# EAGLE design daq_4ch_24bit_eagle (EAGLE 9.4.2)
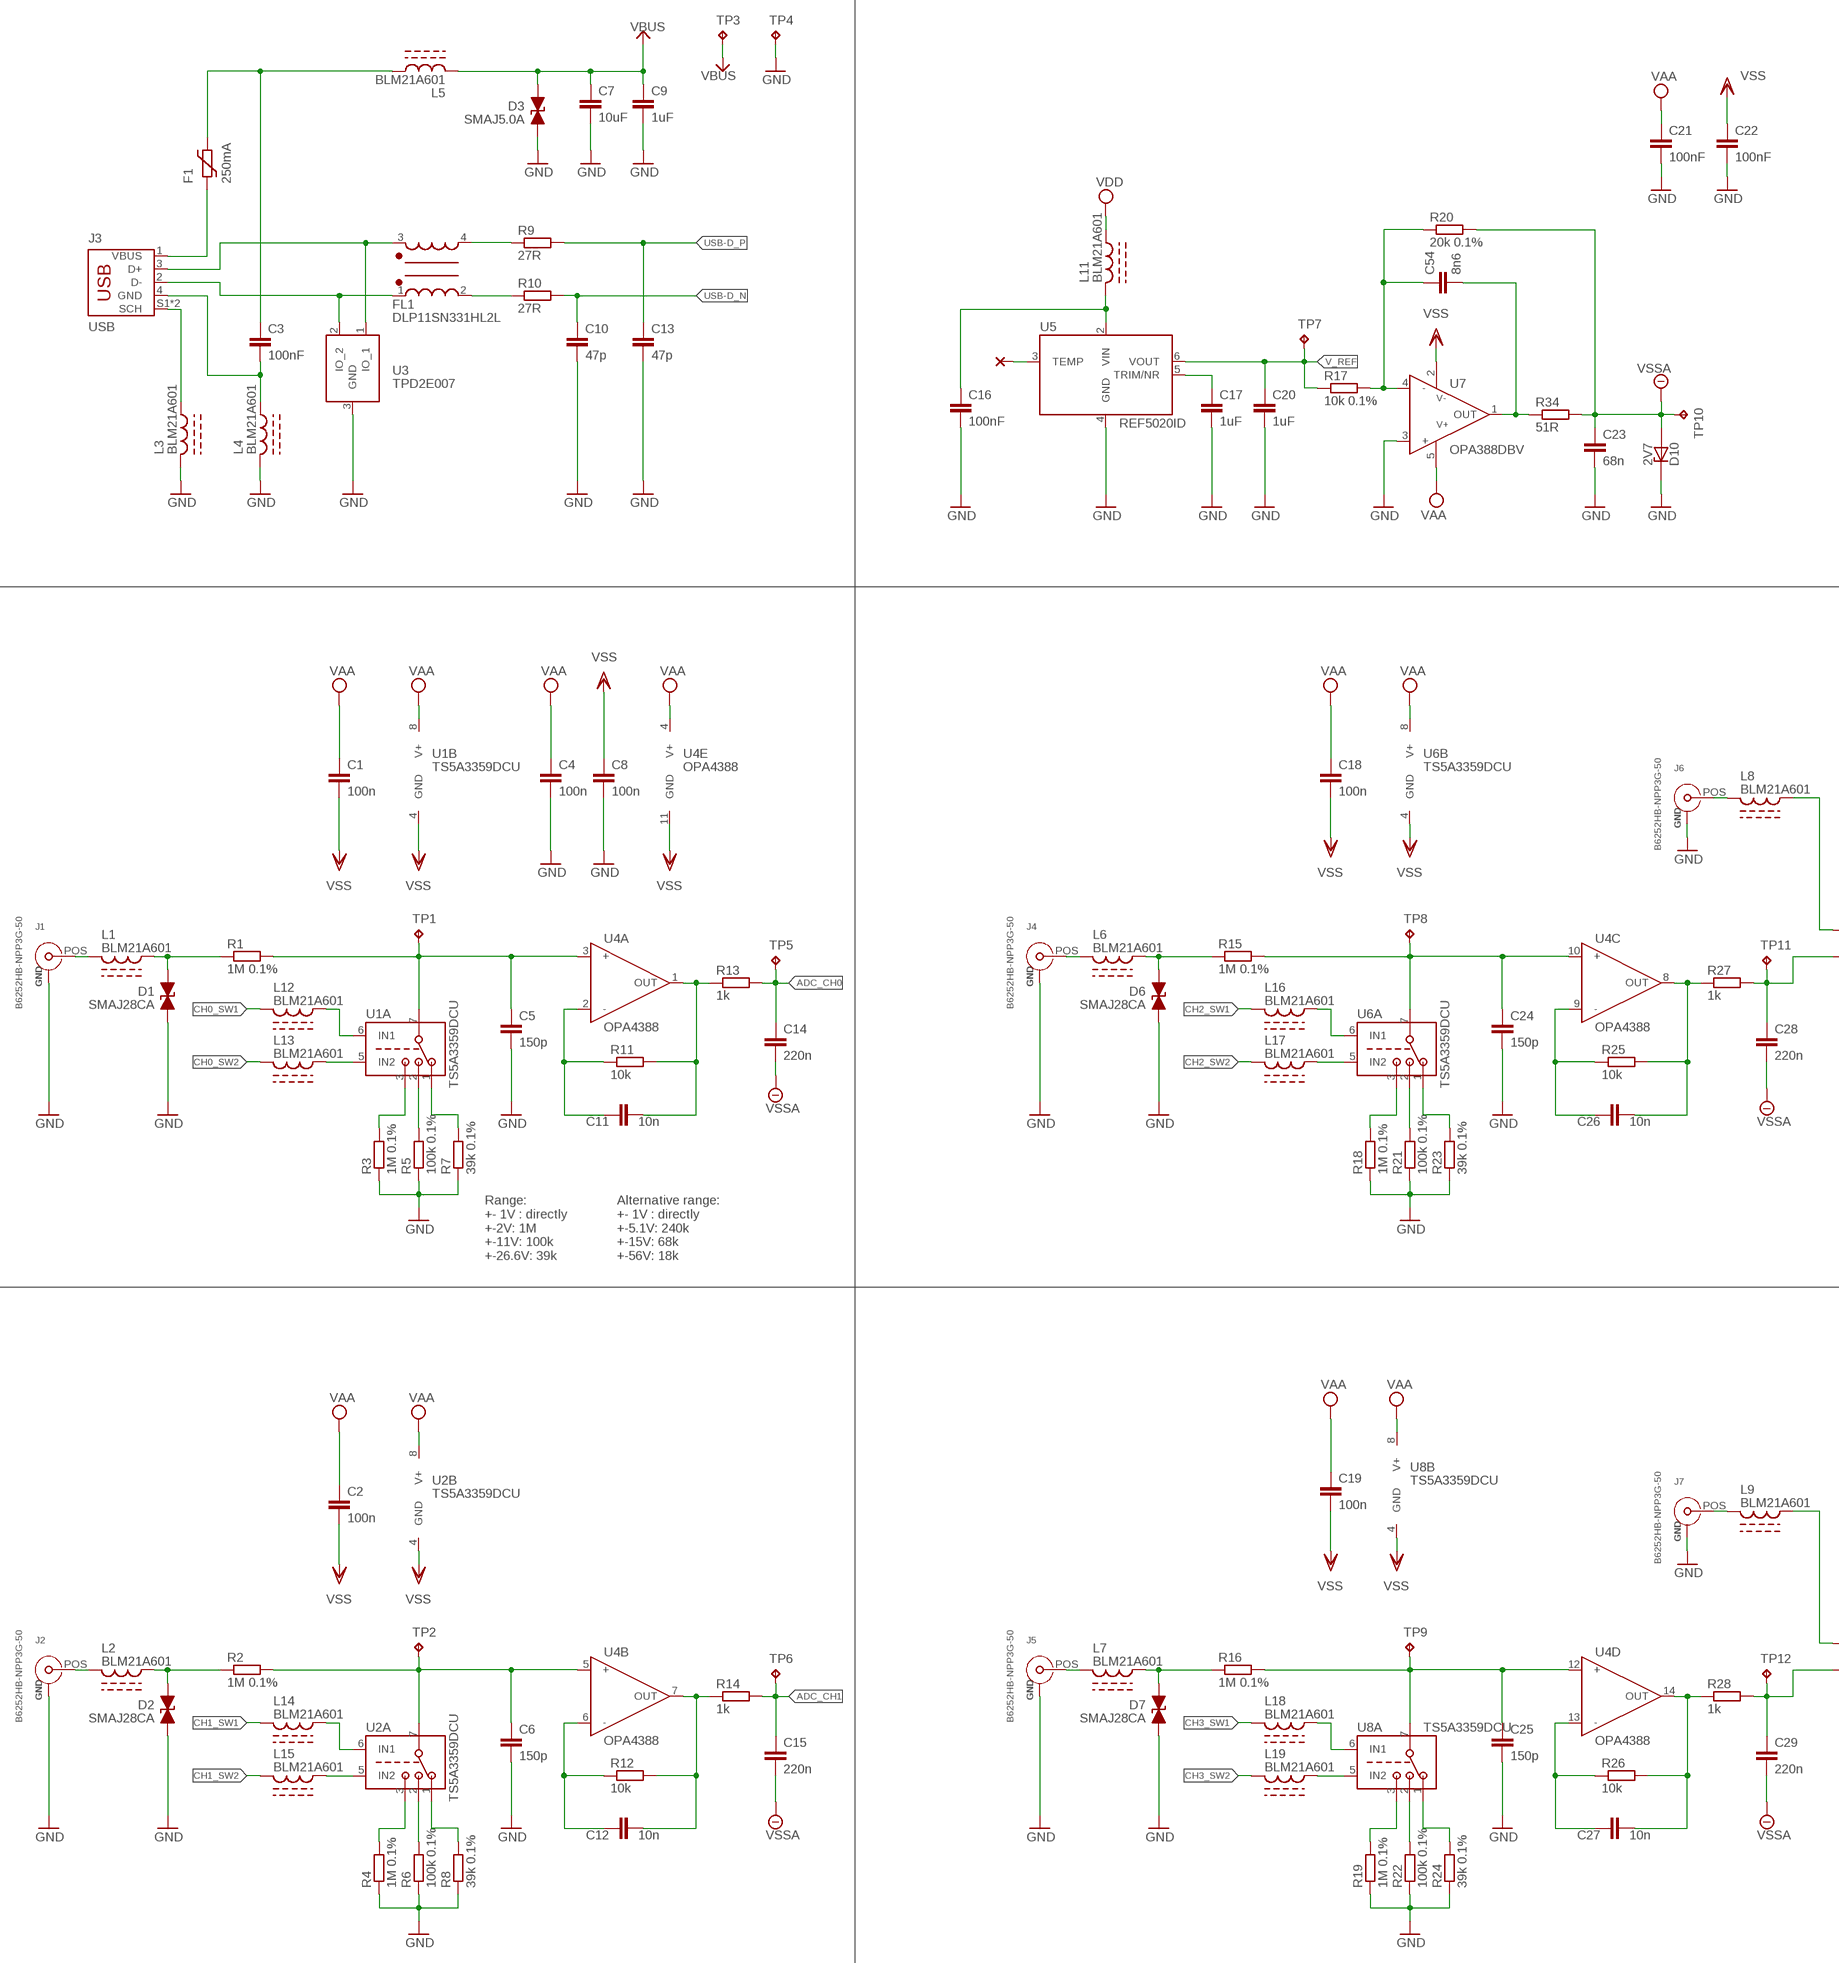
[diagram p0: schematic, sheet 1, part 1 of 2]
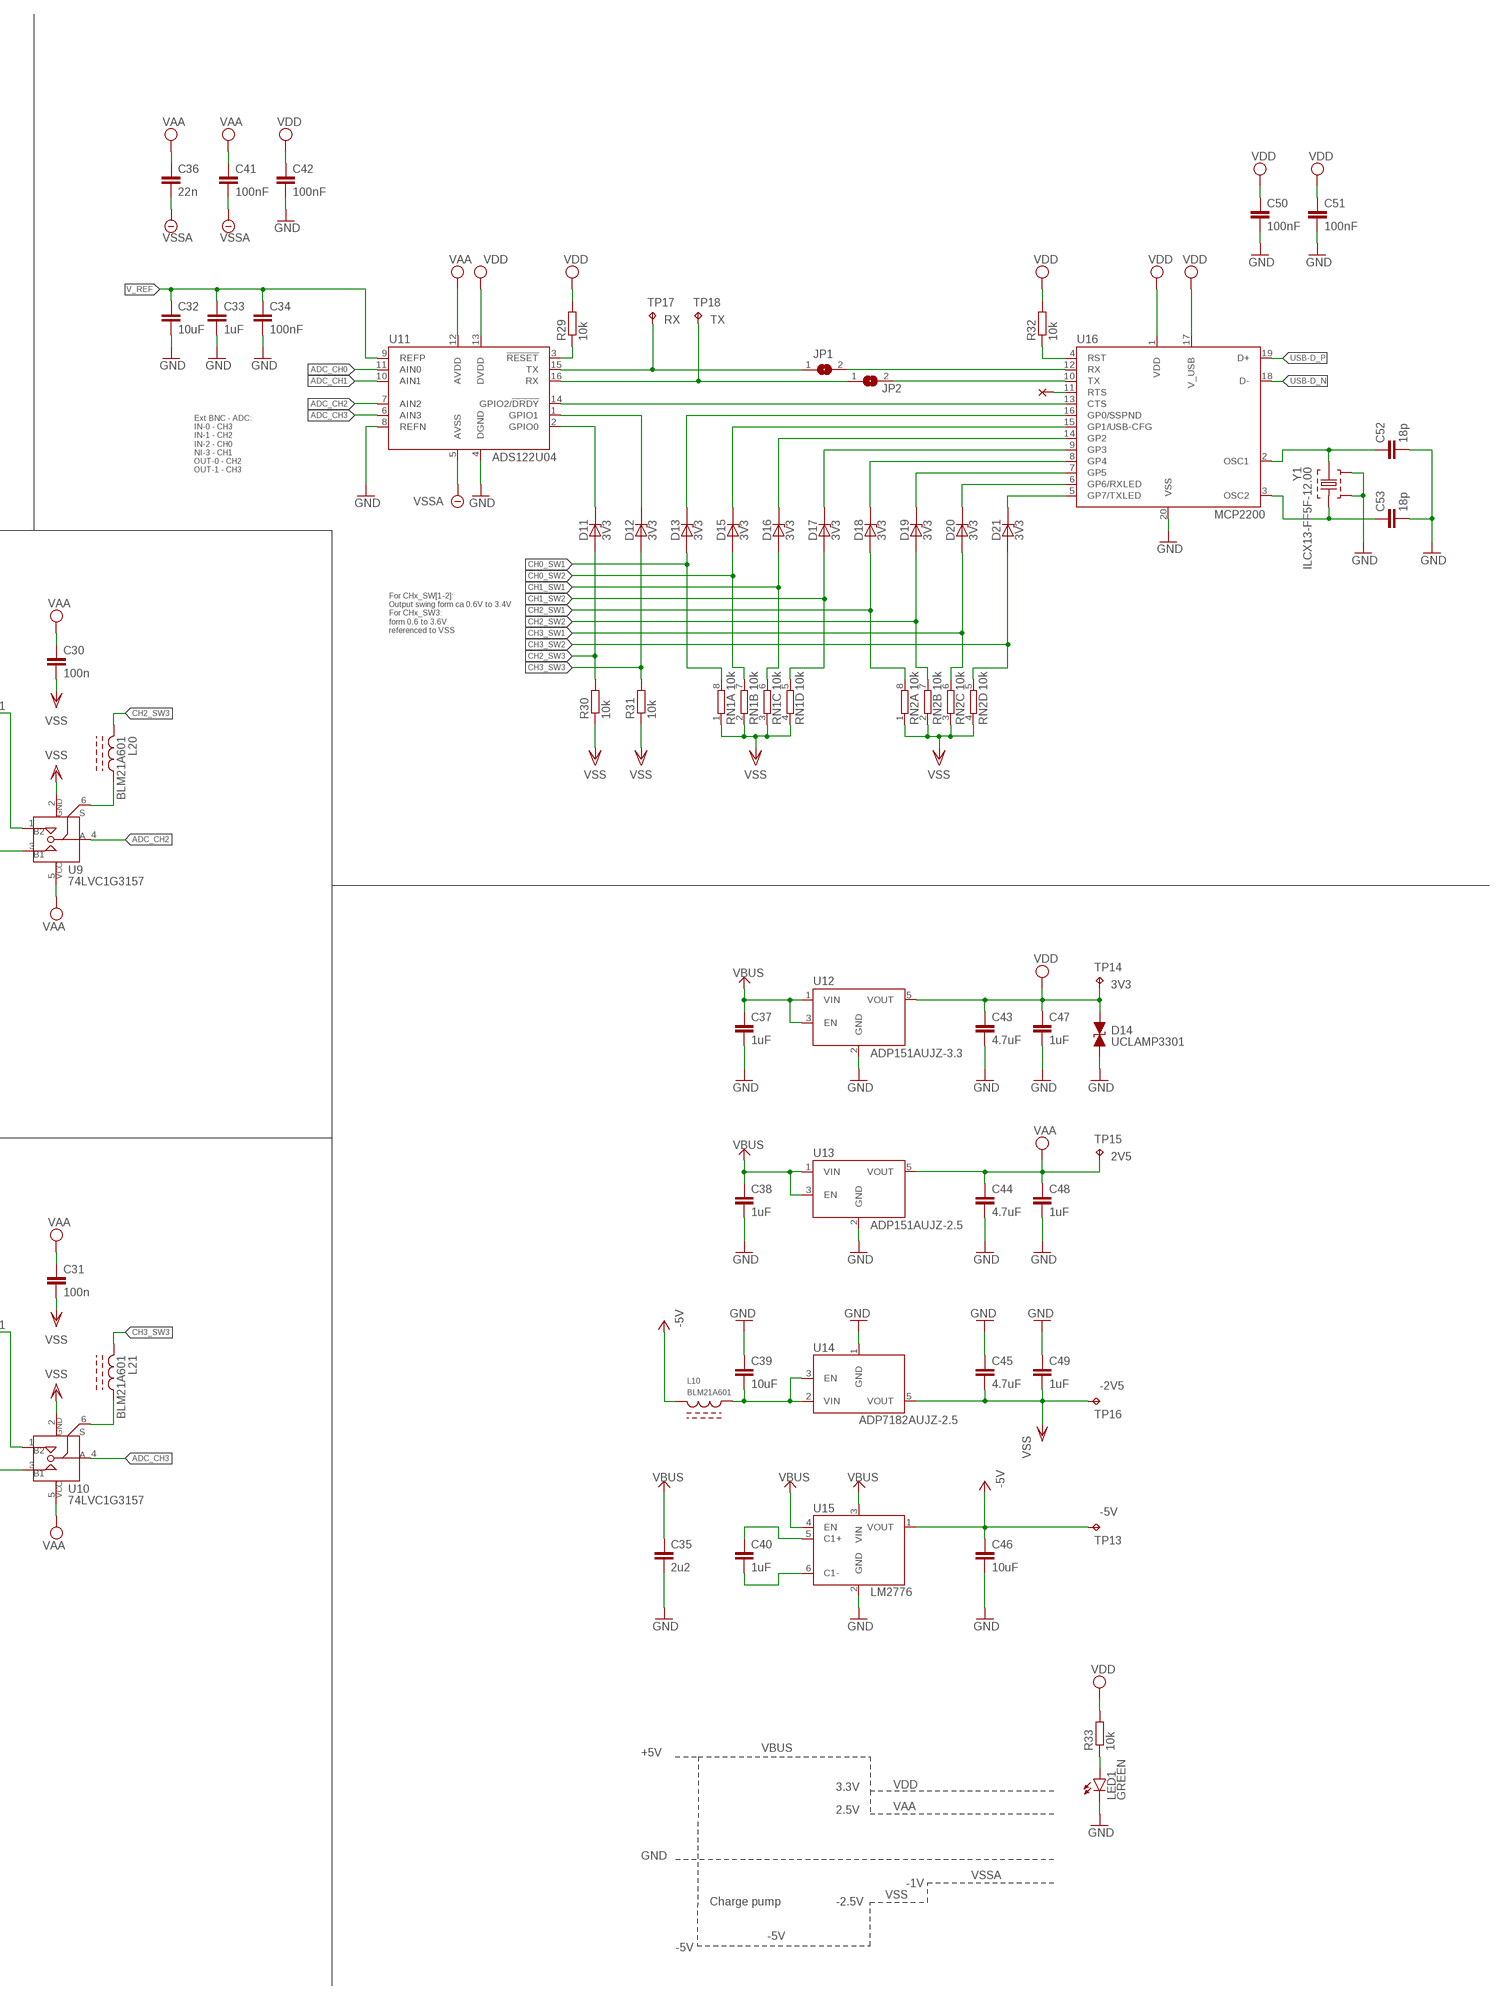
[diagram p1: schematic, sheet 1, part 2 of 2]

## Parts
C1  100n  C-0603  [C0603]
C2  100n  C-0603  [C0603]
C3  100nF  C-0603-100NF-50V  [C0603]
C4  100n  C-0603  [C0603]
C5  150p  C-0603  [C0603]
C6  150p  C-0603  [C0603]
C7  10uF  C-0603-10UF-10V  [C0603]
C8  100n  C-0603  [C0603]
C9  1uF  C-0603-1UF-16V  [C0603]
C10  47p  C-0603  [C0603]
C11  10n  C-0603  [C0603]
C12  10n  C-0603  [C0603]
C13  47p  C-0603  [C0603]
C14  220n  C-0603  [C0603]
C15  220n  C-0603  [C0603]
C16  100nF  C-0603-100NF-50V  [C0603]
C17  1uF  C-0603-1UF-16V  [C0603]
C18  100n  C-0603  [C0603]
C19  100n  C-0603  [C0603]
C20  1uF  C-0603-1UF-16V  [C0603]
C21  100nF  C-0603-100NF-50V  [C0603]
C22  100nF  C-0603-100NF-50V  [C0603]
C23  68n  C-0603  [C0603]
C24  150p  C-0603  [C0603]
C25  150p  C-0603  [C0603]
C26  10n  C-0603  [C0603]
C27  10n  C-0603  [C0603]
C28  220n  C-0603  [C0603]
C29  220n  C-0603  [C0603]
C30  100n  C-0603  [C0603]
C31  100n  C-0603  [C0603]
C32  10uF  C-0603-10UF-10V  [C0603]
C33  1uF  C-0603-1UF-16V  [C0603]
C34  100nF  C-0603-100NF-50V  [C0603]
C35  2u2  C-0603  [C0603]
C36  22n  C-0603  [C0603]
C37  1uF  C-0603-1UF-16V  [C0603]
C38  1uF  C-0603-1UF-16V  [C0603]
C39  10uF  C-0603-10UF-10V  [C0603]
C40  1uF  C-0603-1UF-16V  [C0603]
C41  100nF  C-0603-100NF-50V  [C0603]
C42  100nF  C-0603-100NF-50V  [C0603]
C43  4.7uF  C-0603-4.7UF-10V  [C0603]
C44  4.7uF  C-0603-4.7UF-10V  [C0603]
C45  4.7uF  C-0603-4.7UF-10V  [C0603]
C46  10uF  C-0603-10UF-10V  [C0603]
C47  1uF  C-0603-1UF-16V  [C0603]
C48  1uF  C-0603-1UF-16V  [C0603]
C49  1uF  C-0603-1UF-16V  [C0603]
C50  100nF  C-0603-100NF-50V  [C0603]
C51  100nF  C-0603-100NF-50V  [C0603]
C52  18p  C-0603  [C0603]
C53  18p  C-0603  [C0603]
C54  8n6  C-0603  [C0603]
D1  SMAJ28CA  [SMA(UNI)]
D2  SMAJ28CA  [SMA(UNI)]
D3  SMAJ5.0A  [SMA(UNI)]
D6  SMAJ28CA  [SMA(UNI)]
D7  SMAJ28CA  [SMA(UNI)]
D10  2V7  ZENER-DIODE-SOD323  [SOD323]
D11  3V3  ZENER-DIODE-SOD323  [SOD323]
D12  3V3  ZENER-DIODE-SOD323  [SOD323]
D13  3V3  ZENER-DIODE-SOD323  [SOD323]
D14  UCLAMP3301  [SOD323]
D15  3V3  ZENER-DIODE-SOD323  [SOD323]
D16  3V3  ZENER-DIODE-SOD323  [SOD323]
D17  3V3  ZENER-DIODE-SOD323  [SOD323]
D18  3V3  ZENER-DIODE-SOD323  [SOD323]
D19  3V3  ZENER-DIODE-SOD323  [SOD323]
D20  3V3  ZENER-DIODE-SOD323  [SOD323]
D21  3V3  ZENER-DIODE-SOD323  [SOD323]
F1  250mA  PTC_FUSE_1812  [1812L]
FL1  DLP11SN331HL2L  [DLP11SN331HL2L]
J1  B6252HB-NPP3G-50  [B6252HB-NPP3G-50]
J2  B6252HB-NPP3G-50  [B6252HB-NPP3G-50]
J3  USB  [USB_B_THT]
J4  B6252HB-NPP3G-50  [B6252HB-NPP3G-50]
J5  B6252HB-NPP3G-50  [B6252HB-NPP3G-50]
J6  B6252HB-NPP3G-50  [B6252HB-NPP3G-50]
J7  B6252HB-NPP3G-50  [B6252HB-NPP3G-50]
JP1  SJ  [SJ]
JP2  SJ  [SJ]
L1  BLM21A601  [L0805]
L2  BLM21A601  [L0805]
L3  BLM21A601  [L0805]
L4  BLM21A601  [L0805]
L5  BLM21A601  [L0805]
L6  BLM21A601  [L0805]
L7  BLM21A601  [L0805]
L8  BLM21A601  [L0805]
L9  BLM21A601  [L0805]
L10  BLM21A601  [L0805]
L11  BLM21A601  [L0805]
L12  BLM21A601  [L0805]
L13  BLM21A601  [L0805]
L14  BLM21A601  [L0805]
L15  BLM21A601  [L0805]
L16  BLM21A601  [L0805]
L17  BLM21A601  [L0805]
L18  BLM21A601  [L0805]
L19  BLM21A601  [L0805]
L20  BLM21A601  [L0805]
L21  BLM21A601  [L0805]
LED1  GREEN  LED5MM  [LED5MM]
R1  1M 0.1%  R-EU_R0603  [R0603]
R2  1M 0.1%  R-EU_R0603  [R0603]
R3  1M 0.1%  R-EU_R0603  [R0603]
R4  1M 0.1%  R-EU_R0603  [R0603]
R5  100k 0.1%  R-EU_R0603  [R0603]
R6  100k 0.1%  R-EU_R0603  [R0603]
R7  39k 0.1%  R-EU_R0603  [R0603]
R8  39k 0.1%  R-EU_R0603  [R0603]
R9  27R  R-EU_R0603  [R0603]
R10  27R  R-EU_R0603  [R0603]
R11  10k  R-EU_R0603  [R0603]
R12  10k  R-EU_R0603  [R0603]
R13  1k  R-EU_R0603  [R0603]
R14  1k  R-EU_R0603  [R0603]
R15  1M 0.1%  R-EU_R0603  [R0603]
R16  1M 0.1%  R-EU_R0603  [R0603]
R17  10k 0.1%  R-EU_R0603  [R0603]
R18  1M 0.1%  R-EU_R0603  [R0603]
R19  1M 0.1%  R-EU_R0603  [R0603]
R20  20k 0.1%  R-EU_R0603  [R0603]
R21  100k 0.1%  R-EU_R0603  [R0603]
R22  100k 0.1%  R-EU_R0603  [R0603]
R23  39k 0.1%  R-EU_R0603  [R0603]
R24  39k 0.1%  R-EU_R0603  [R0603]
R25  10k  R-EU_R0603  [R0603]
R26  10k  R-EU_R0603  [R0603]
R27  1k  R-EU_R0603  [R0603]
R28  1k  R-EU_R0603  [R0603]
R29  10k  R-EU_R0603  [R0603]
R30  10k  R-EU_R0603  [R0603]
R31  10k  R-EU_R0603  [R0603]
R32  10k  R-EU_R0603  [R0603]
R33  10k  R-EU_R0603  [R0603]
R34  51R  R-EU_R0603  [R0603]
RN1  10k  4R-N0603-ARV  [0603-ARV]
RN2  10k  4R-N0603-ARV  [0603-ARV]
TP1  3V3  TPB1,27  [B1,27]
TP2  3V3  TPB1,27  [B1,27]
TP3  3V3  TPB1,27  [B1,27]
TP4  3V3  TPB1,27  [B1,27]
TP5  3V3  TPB1,27  [B1,27]
TP6  3V3  TPB1,27  [B1,27]
TP7  3V3  TPB1,27  [B1,27]
TP8  3V3  TPB1,27  [B1,27]
TP9  3V3  TPB1,27  [B1,27]
TP10  3V3  TPB1,27  [B1,27]
TP11  3V3  TPB1,27  [B1,27]
TP12  3V3  TPB1,27  [B1,27]
TP13  -5V  TPB1,27  [B1,27]
TP14  3V3  TPB1,27  [B1,27]
TP15  2V5  TPB1,27  [B1,27]
TP16  -2V5  TPB1,27  [B1,27]
TP17  RX  TPB1,27  [B1,27]
TP18  TX  TPB1,27  [B1,27]
U1  TS5A3359DCU  [DCU]
U2  TS5A3359DCU  [DCU]
U3  TPD2E007  [SOT323]
U4  OPA4388  [SOIC14]
U5  REF5020ID  [SOIC8]
U6  TS5A3359DCU  [DCU]
U7  OPA388DBV  [SOT23-5]
U8  TS5A3359DCU  [DCU]
U9  74LVC1G3157  [SOT23-6]
U10  74LVC1G3157  [SOT23-6]
U11  ADS122U04  [SSOP16]
U12  ADP151AUJZ-3.3  [SOT23-5]
U13  ADP151AUJZ-2.5  [SOT23-5]
U14  ADP7182AUJZ-2.5  [SOT23-5]
U15  LM2776  [SOT23-6]
U16  MCP2200  [SSOP20]
U$2  NC  (no package)
U$3  NC  (no package)
Y1  ILCX13-FF5F-12.00  [ILCX13]

## Nets
-5V: C46.1 L10.1 TP13.TP U15.1(VOUT)
ADC_CH0: C14.1 R13.2 TP5.TP U11.11(AIN0)
ADC_CH1: C15.1 R14.2 TP6.TP U11.10(AIN1)
ADC_CH2: U9.4(A) U11.7(AIN2)
ADC_CH3: U10.4(A) U11.6(AIN3)
CH0_SW1: D13.A L12.1 RN1.8
CH0_SW2: D15.A L13.1 RN1.7
CH1_SW1: D16.A L14.1 RN1.6
CH1_SW2: D17.A L15.1 RN1.5
CH2_SW1: D18.A L16.1 RN2.8
CH2_SW2: D19.A L17.1 RN2.7
CH2_SW3: D11.A L20.1 R30.2
CH3_SW1: D20.A L18.1 RN2.6
CH3_SW2: D21.A L19.1 RN2.5
CH3_SW3: D12.A L21.1 R31.2
GND: C4.2 C5.2 C6.2 C7.2 C8.2 C9.2 C10.2 C13.2 C16.2 C17.2 C20.2 C21.2 C22.2 C23.2 C24.2 C25.2 C32.2 C33.2 C34.2 C35.2 C37.2 C38.2 C39.1 C42.2 C43.2 C44.2 C45.1 C46.2 C47.2 C48.2 C49.1 C50.2 C51.2 C52.2 C53.2 D1.2 D2.2 D3.2 D6.2 D7.2 D10.C D14.C J1.2(GND) J1.3(GND) J1.4(GND) J2.2(GND) J2.3(GND) J2.4(GND) J4.2(GND) J4.3(GND) J4.4(GND) J5.2(GND) J5.3(GND) J5.4(GND) J6.2(GND) J6.3(GND) J6.4(GND) J7.2(GND) J7.3(GND) J7.4(GND) L3.1 L4.1 LED1.K(C) R3.1 R4.1 R5.1 R6.1 R7.1 R8.1 R18.1 R19.1 R21.1 R22.1 R23.1 R24.1 TP4.TP U3.3(GND) U5.4(GND) U7.3(+) U11.4(DGND) U11.8(REFN) U12.2(GND) U13.2(GND) U14.1(GND) U15.2(GND) U16.20(VSS) Y1.2 Y1.4
N$1: C40.1 U15.5(C1+)
N$2: C40.2 U15.6(C1-)
N$3: C39.2 L10.2 U14.2(VIN) U14.3(EN)
N$4: D21.C U16.5(GP7/TXLED)
N$5: D20.C U16.6(GP6/RXLED)
N$6: D19.C U16.7(GP5)
N$7: D18.C U16.8(GP4)
N$8: D17.C U16.9(GP3)
N$9: D16.C U16.14(GP2)
N$10: D15.C U16.15(GP1/USB-CFG)
N$11: D13.C U16.16(GP0/SSPND)
N$12: D11.C U11.2(GPIO0)
N$13: D12.C U11.1(GPIO1)
N$14: JP2.1 TP18.TP U11.16(RX)
N$15: JP1.1 TP17.TP U11.15(TX)
N$20: R32.1 U16.4(RST)
N$21: JP1.2 U16.12(RX)
N$22: JP2.2 U16.10(TX)
N$23: U11.14(GPIO2/!DRDY) U16.13(CTS)
N$24: R29.1 U11.3(!RESET)
N$25: LED1.A R33.1
N$26: C3.1 F1.2 L5.2
N$29: J3.S1(SCH) J3.S2(SCH) L3.2
N$30: FL1.2 R10.1
N$31: FL1.4 R9.1
N$34: C16.1 L11.1 U5.2(VIN)
N$35: C17.1 U5.5(TRIM/NR)
N$36: C54.2 R34.1 U7.1(OUT)
N$37: C54.1 R17.2 R20.1 U7.4(-)
N$38: U5.3(TEMP) U$2.P$1
N$39: U16.11(RTS) U$3.P$1
N$40: C52.1 U16.2(OSC1) Y1.1
N$41: C53.1 U16.3(OSC2) Y1.3
N$42: J1.POS L1.1
N$43: D1.1 L1.2 R1.1
N$44: C11.2 R11.2 R13.1 U4.1(A:OUT)
N$45: R5.2 U1.2(A:NO1)
N$46: L13.2 U1.5(A:IN2)
N$47: L12.2 U1.6(A:IN1)
N$48: C5.1 R1.2 TP1.TP U1.7(A:COM) U4.3(A:+)
N$49: R7.2 U1.1(A:NO0)
N$50: R3.2 U1.3(A:NO2)
N$51: C11.1 R11.1 U4.2(A:-)
N$52: J4.POS L6.1
N$53: D6.1 L6.2 R15.1
N$54: L17.2 U6.5(A:IN2)
N$55: L16.2 U6.6(A:IN1)
N$56: C24.1 R15.2 TP8.TP U4.10(C:+) U6.7(A:COM)
N$57: R21.2 U6.2(A:NO1)
N$58: R23.2 U6.1(A:NO0)
N$59: R18.2 U6.3(A:NO2)
N$61: C26.2 R25.2 R27.1 U4.8(C:OUT)
N$62: C26.1 R25.1 U4.9(C:-)
N$63: C28.1 R27.2 TP11.TP U9.3(B1)
N$64: J6.POS L8.1
N$65: L8.2 U9.1(B2)
N$66: L20.2 U9.6(S)
N$67: J2.POS L2.1
N$68: D2.1 L2.2 R2.1
N$69: L15.2 U2.5(A:IN2)
N$70: L14.2 U2.6(A:IN1)
N$71: C6.1 R2.2 TP2.TP U2.7(A:COM) U4.5(B:+)
N$72: R6.2 U2.2(A:NO1)
N$73: R8.2 U2.1(A:NO0)
N$74: R4.2 U2.3(A:NO2)
N$75: C12.2 R12.2 R14.1 U4.7(B:OUT)
N$76: C12.1 R12.1 U4.6(B:-)
N$77: J5.POS L7.1
N$78: D7.1 L7.2 R16.1
N$79: L19.2 U8.5(A:IN2)
N$80: L18.2 U8.6(A:IN1)
N$81: C25.1 R16.2 TP9.TP U4.12(D:+) U8.7(A:COM)
N$82: R22.2 U8.2(A:NO1)
N$83: R24.2 U8.1(A:NO0)
N$84: R19.2 U8.3(A:NO2)
N$85: C27.2 R26.2 R28.1 U4.14(D:OUT)
N$86: C27.1 R26.1 U4.13(D:-)
N$87: C29.1 R28.2 TP12.TP U10.3(B1)
N$88: J7.POS L9.1
N$89: L9.2 U10.1(B2)
N$90: L21.2 U10.6(S)
USB-D_N [USB]: C10.1 R10.2 U16.18(D-)
USB-D_P [USB]: C13.1 R9.2 U16.19(D+)
USBD_N [USB]: FL1.1 J3.2(D-) U3.2(IO_2)
USBD_P [USB]: FL1.3 J3.3(D+) U3.1(IO_1)
USBGND: C3.2 J3.4(GND) L4.2
V_REF: C20.1 C32.1 C33.1 C34.1 R17.1 TP7.TP U5.6(VOUT) U11.9(REFP)
VAA: C1.1 C2.1 C4.1 C18.1 C19.1 C21.1 C30.1 C31.1 C36.1 C41.1 C44.1 C48.1 TP15.TP U1.8(B:V+) U2.8(B:V+) U4.4(E:V+) U6.8(B:V+) U7.5(V+) U8.8(B:V+) U9.5(VCC) U10.5(VCC) U11.12(AVDD) U13.5(VOUT)
VBUS: C7.1 C9.1 C35.1 C37.1 C38.1 D3.1 L5.1 TP3.TP U12.1(VIN) U12.3(EN) U13.1(VIN) U13.3(EN) U15.3(VIN) U15.4(EN)
VDD: C42.1 C43.1 C47.1 C50.1 C51.1 D14.A L11.2 R29.2 R32.2 R33.2 TP14.TP U11.13(DVDD) U12.5(VOUT) U16.1(VDD) U16.17(V_USB)
VSS: C1.2 C2.2 C8.1 C18.2 C19.2 C22.1 C30.2 C31.2 C45.2 C49.2 R30.1 R31.1 RN1.1 RN1.2 RN1.3 RN1.4 RN2.1 RN2.2 RN2.3 RN2.4 TP16.TP U1.4(B:GND) U2.4(B:GND) U4.11(E:GND) U6.4(B:GND) U7.2(GND) U8.4(B:GND) U9.2(GND) U10.2(GND) U14.5(VOUT)
VSSA: C14.2 C15.2 C23.1 C28.2 C29.2 C36.2 C41.2 D10.A R20.2 R34.2 TP10.TP U11.5(AVSS)
VUSB: F1.1 J3.1(VBUS)

## Notes on the sheet
- RX | TX
- Ext BNC - ADC:
  IN-0 - CH3
  IN-1 - CH2
  IN-2 - CH0
  NI-3 - CH1
  OUT-0 - CH2
  OUT-1 - CH3
- For CHx_SW[1-2]:
  Output swing form ca 0.6V to 3.4V
  For CHx_SW3:
  form 0.6 to 3.6V
  referenced to VSS
- 3V3
- Range:
  +- 1V : directly
  +-2V: 1M
  +-11V: 100k
  +-26.6V: 39k
- Alternative range:
  +- 1V : directly
  +-5.1V: 240k
  +-15V: 68k
  +-56V: 18k
- 2V5
- -2V5
- -5V
- VBUS
- +5V
- 3.3V | VDD
- VAA
- 2.5V
- GND
- VSSA
- -1V
- VSS
- Charge pump | -2.5V
- -5V
- -5V

## Library data of the parts
C1 C2 C4-C6 C8 C10-C15 C18 C19 C23-C31 C35 C36 C52-C54 = 1_passive:C?*: MLCC capacitor
C3 C16 C21 C22 C34 C41 C42 C50 C51 = 1_passive:C?*: MLCC capacitor; TOLERANCE: 10%; VOLTAGE: 50V
C7 C32 C39 C46 = 1_passive:C?*: MLCC capacitor; TOLERANCE: 20%; VOLTAGE: 10V
C9 C17 C20 C33 C37 C38 C40 C47-C49 = 1_passive:C?*: MLCC capacitor; TOLERANCE: 10%; VOLTAGE: 16V
C43-C45 = 1_passive:C?*: MLCC capacitor; TOLERANCE: 10%; VOLTAGE: 10V
D1 D2 D6 D7 = DAQ_24bit_Hardware:SMAJ28CA
D3 = DAQ_24bit_Hardware:SMAJ5.0A
D10-D13 D15-D21 = 1_semiconductors:ZENER-DIODE: Zener diode
D14 = DAQ_24bit_Hardware:UCLAMP3301
F1 = 1_passive:PTC_FUSE: PTC FUSE
FL1 = DAQ_24bit_Hardware:DLP11SN331HL2L
J1 J2 J4-J7 = DAQ_24bit_Hardware:B6252HB-NPP3G-50
J3 = DAQ_24bit_Hardware:USB
JP1 JP2 = jumper:SJ: SMD solder JUMPER
L1-L21 = DAQ_24bit_Hardware:BLM21A601
LED1 = led:LED: LED OSRAM: - CHIPLED LG R971, LG N971, LY N971, LG Q971, LY Q971, LO R971, LY R971 LH N974, LH R974 LS Q976, LO Q976, LY Q976 LO Q996 - Hyper CHIPLED LW Q18S LB Q993, LB Q99A, LB R99A - SideLED LS A670, LO A670, LY A670, LG A670, LP A670 LB A673, LV A673, LT A673, LW A673 LH A674 LY A675 LS A676, LA A676, LO A676, LY A676, LW A676 LS A679, LY A679, LG A679 - Hyper Micro SIDELED® LS Y876, LA Y876, LO Y876, LY Y876 LT Y87S - SmartLED LW L88C, LW L88S LB L89C, LB L89S, LG L890 LS L89K, LO L89K, LY L89K LS L896, LA L896, LO L896, LY L896 - TOPLED LS T670, LO T670, LY T670, LG T670, LP T670 LSG T670, LSP T670, LSY T670, LOP T670, LYG T670 LG T671, LOG T671, LSG T671 LB T673, LV T673, LT T673, LW T673 LH T674 LS T676, LA T676, LO T676, LY T676, LB T676, LH T676, LSB T676, LW T676 LB T67C, LV T67C, LT T67C, LS T67K, LO T67K, LY T67K, LW E67C LS E67B, LA E67B, LO E67B, LY E67B, LB E67C, LV E67C, LT E67C LW T67C LS T679, LY T679, LG T679 LS T770, LO T770, LY T770, LG T770, LP T770 LB T773, LV T773, LT T773, LW T773 LH T774 LS E675, LA E675, LY E675, LS T675 LS T776, LA T776, LO T776, LY T776, LB T776 LHGB T686 LT T68C, LB T68C - Hyper Mini TOPLED® LB M676 - Mini TOPLED Santana® LG M470 LS M47K, LO M47K, LY M47K Source: http://www.osram.convergy.de LUXEON: - LUMILED® LXK2-PW12-R00, LXK2-PW12-S00, LXK2-PW14-U00, LXK2-PW14-V00 LXK2-PM12-R00, LXK2-PM12-S00, LXK2-PM14-U00 LXK2-PE12-Q00, LXK2-PE12-R00, LXK2-PE12-S00, LXK2-PE14-T00, LXK2-PE14-U00 LXK2-PB12-K00, LXK2-PB12-L00, LXK2-PB12-M00, LXK2-PB14-N00, LXK2-PB14-P00, LXK2-PB14-Q00 LXK2-PR12-L00, LXK2-PR12-M00, LXK2-PR14-Q00, LXK2-PR14-R00 LXK2-PD12-Q00, LXK2-PD12-R00, LXK2-PD12-S00 LXK2-PH12-R00, LXK2-PH12-S00 LXK2-PL12-P00, LXK2-PL12-Q00, LXK2-PL12-R00 Source: www.luxeon.com KINGBRIGHT: KA-3528ASYC Source: www.kingbright.com
R1-R34 = 1_passive:R-EU_: RESISTOR; POWER: 0.1W; TOLERANCE: 1%
RN1 RN2 = resistor-dil:4R-N: Array Chip Resistor Source: RS Component / Phycomp; OC_FARNELL: unknown; OC_NEWARK: unknown
TP1-TP18 = testpad:TP: Test pad
U1 U2 U6 U8 = DAQ_24bit_Hardware:TS5A3359DCU
U3 = DAQ_24bit_Hardware:TPD2E007
U4 = DAQ_24bit_Hardware:OPA4388
U5 = DAQ_24bit_Hardware:REF5020ID
U7 = DAQ_24bit_Hardware:OPA388DBV
U9 U10 = DAQ_24bit_Hardware:74LVC1G3157
U11 = DAQ_24bit_Hardware:ADS122U04
U12 = DAQ_24bit_Hardware:ADP151AUJZ-3.3
U13 = DAQ_24bit_Hardware:ADP151AUJZ-2.5
U14 = DAQ_24bit_Hardware:ADP7182AUJZ-2.5
U15 = DAQ_24bit_Hardware:LM2776
U16 = DAQ_24bit_Hardware:MCP2200
U$2 U$3 = 1_connectors:NC: XXXXXXXXX No-connection. Use this to explicitly mark that something in schematic should not be connected. No footprint, no datasheet. XXXXXXXXX
Y1 = DAQ_24bit_Hardware:ILCX13-FF5F-12.00

## Net classes
0 default: width 0.152 mm, drill 0.406 mm
1 USB: width 0.203 mm, drill 0.406 mm

## Board
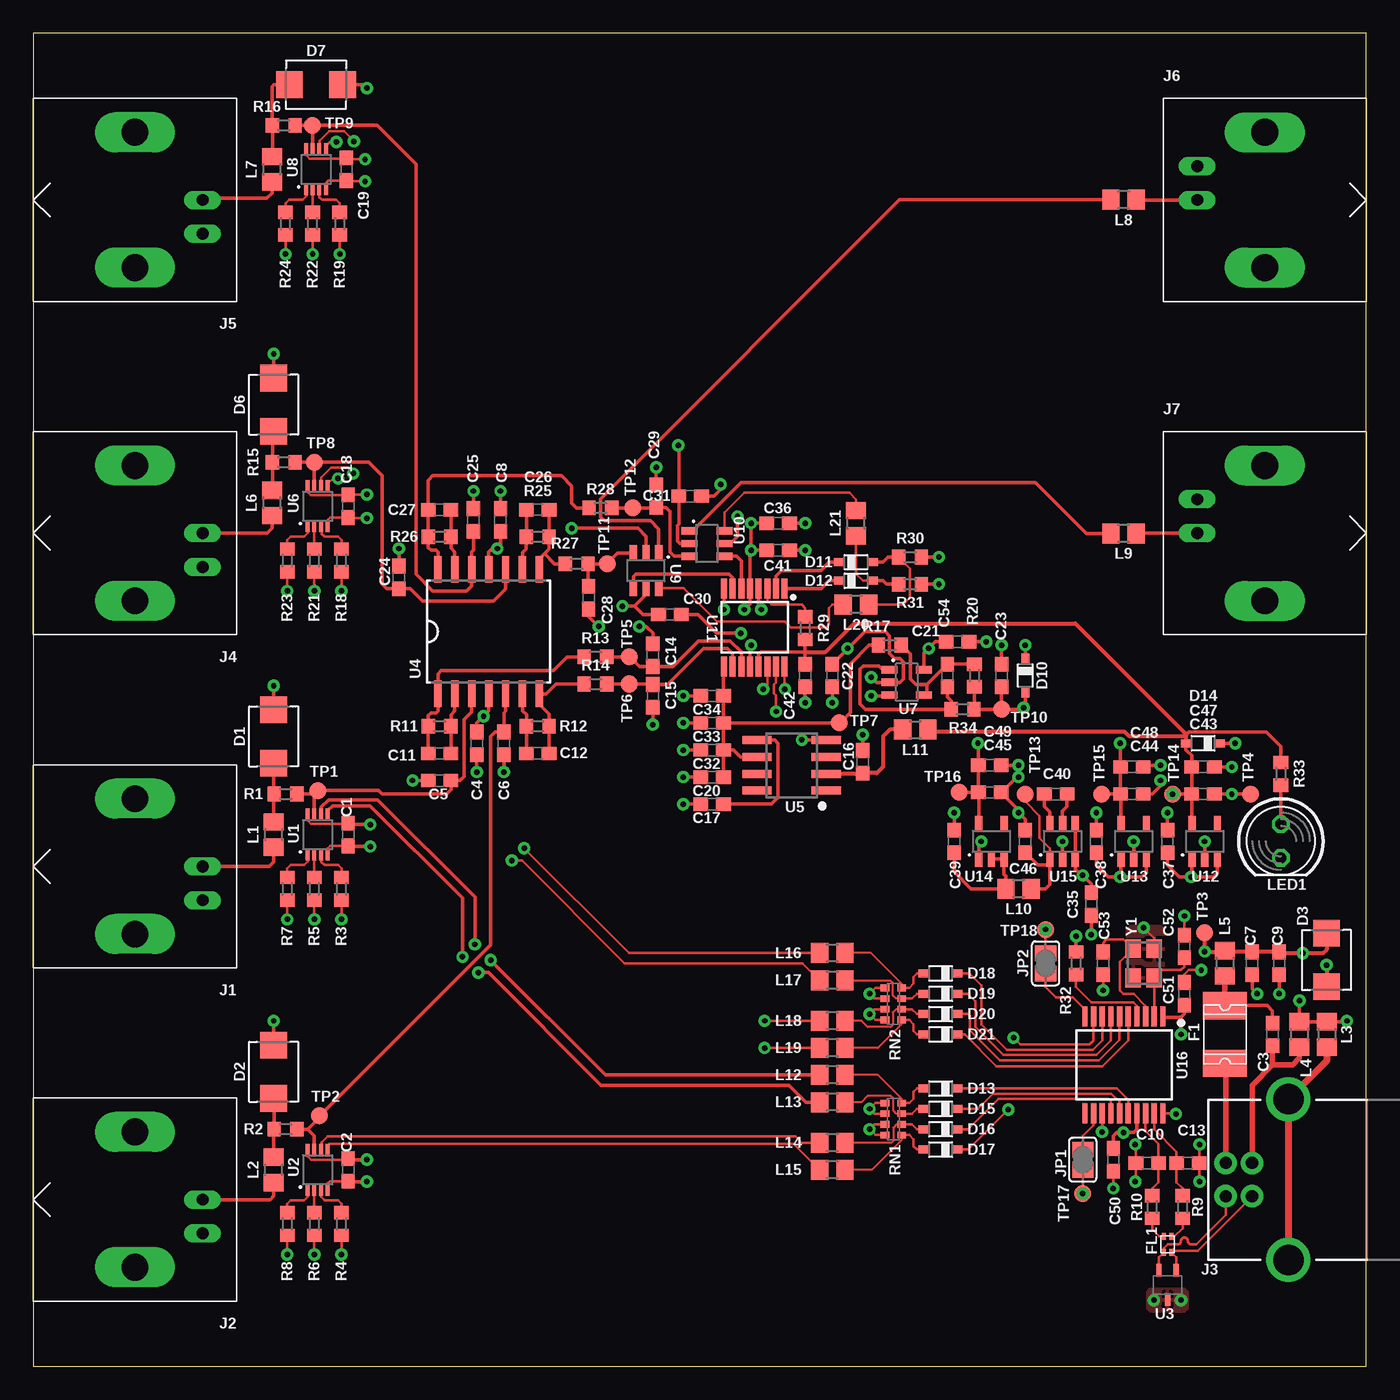
[diagram p2: board, top side]
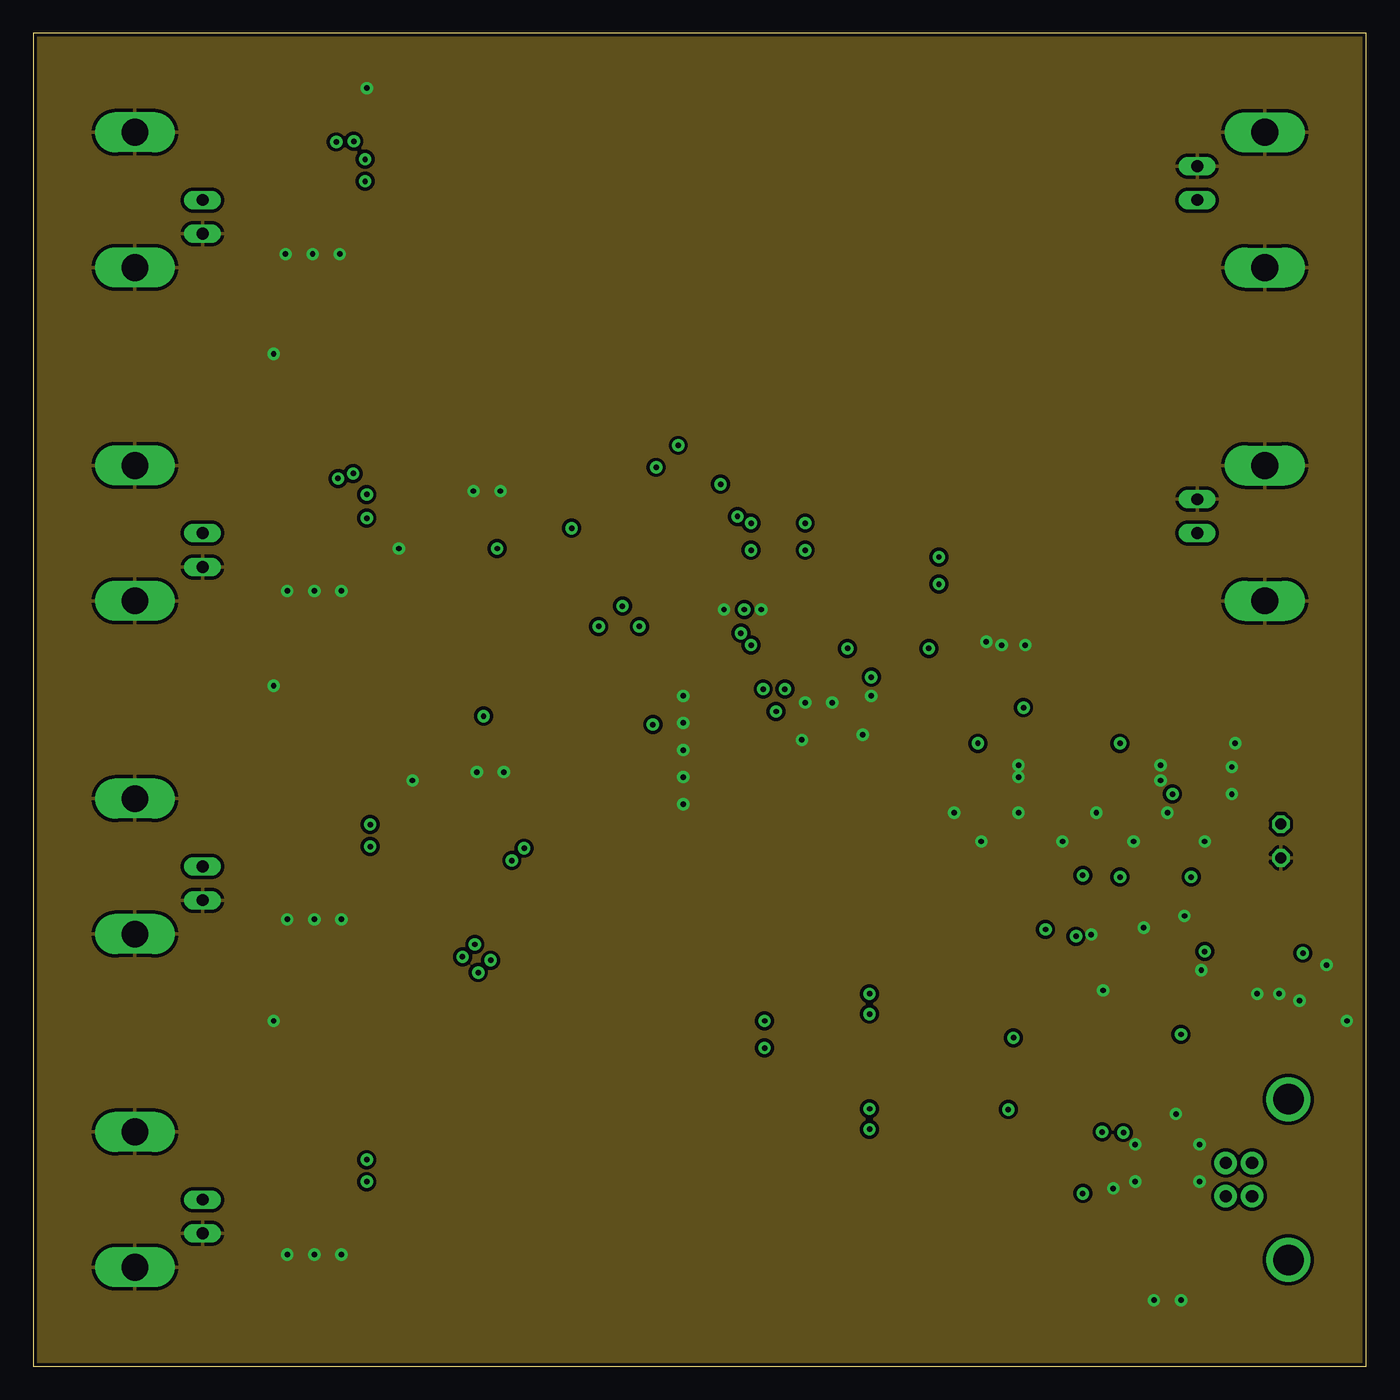
[diagram p3: board, inner layer Route2]
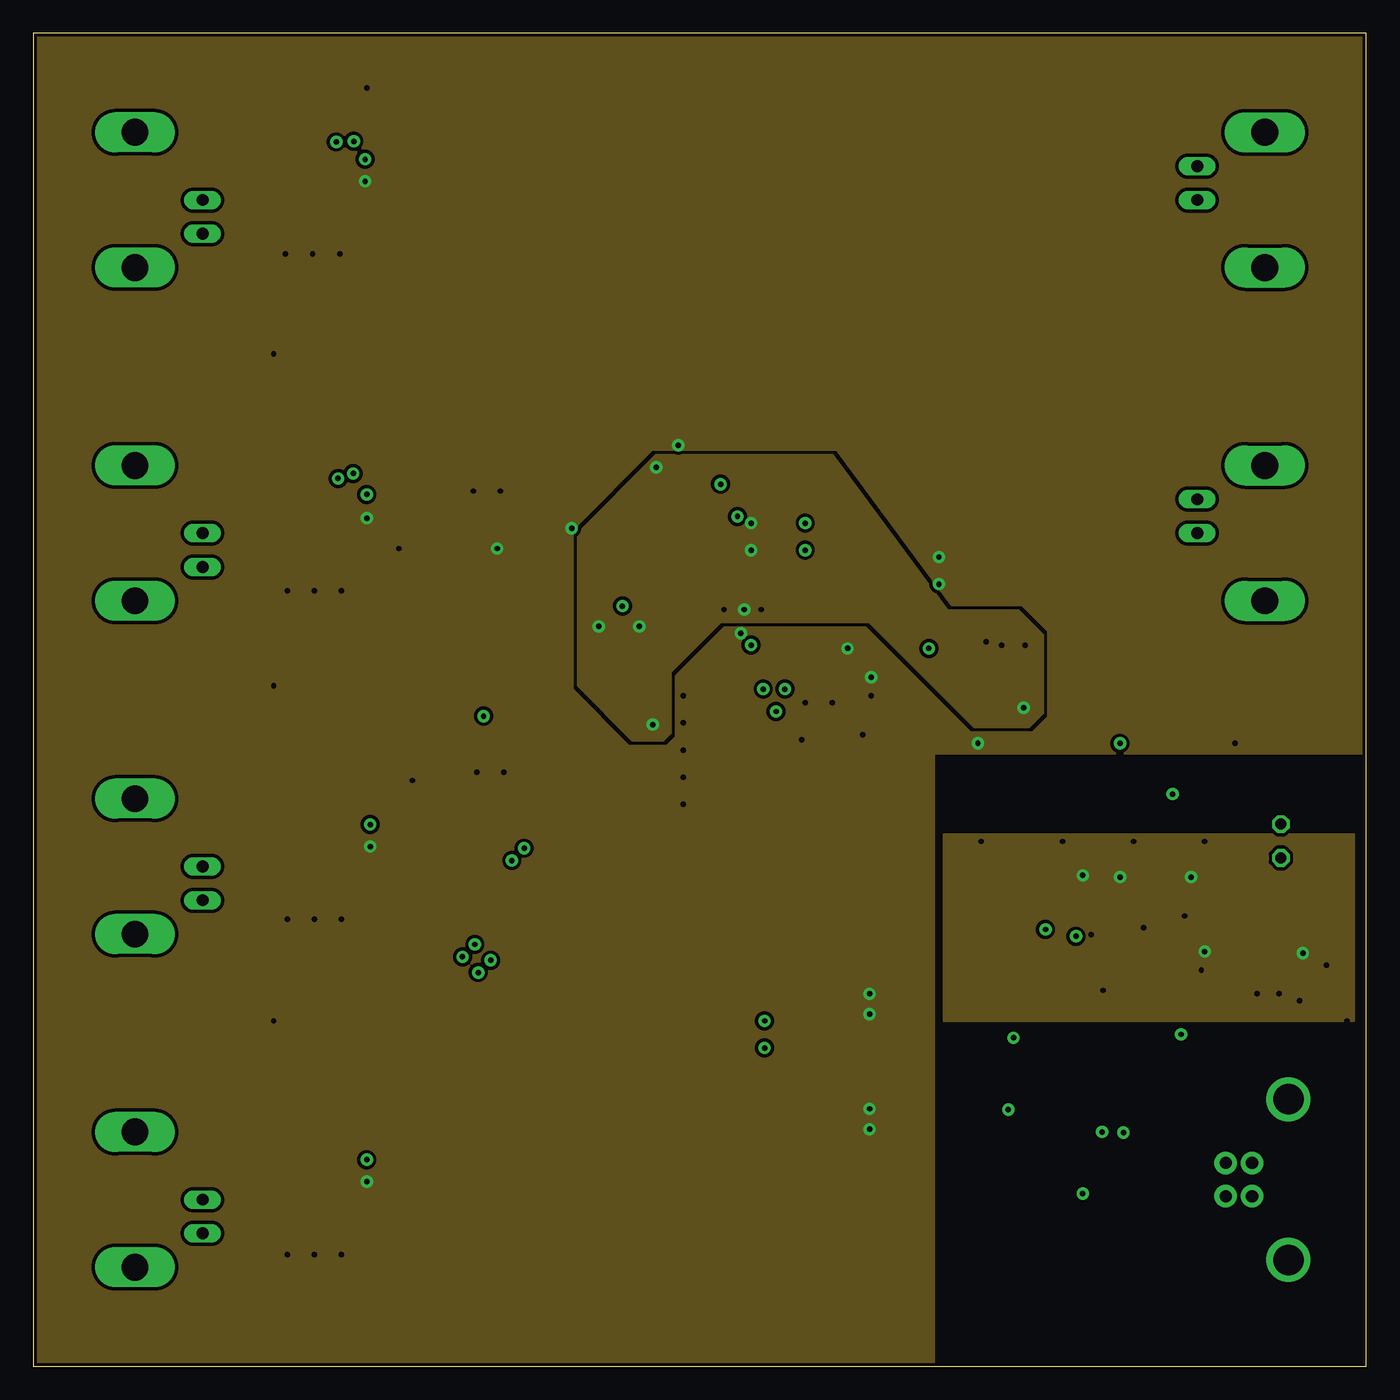
[diagram p4: board, inner layer Route15]
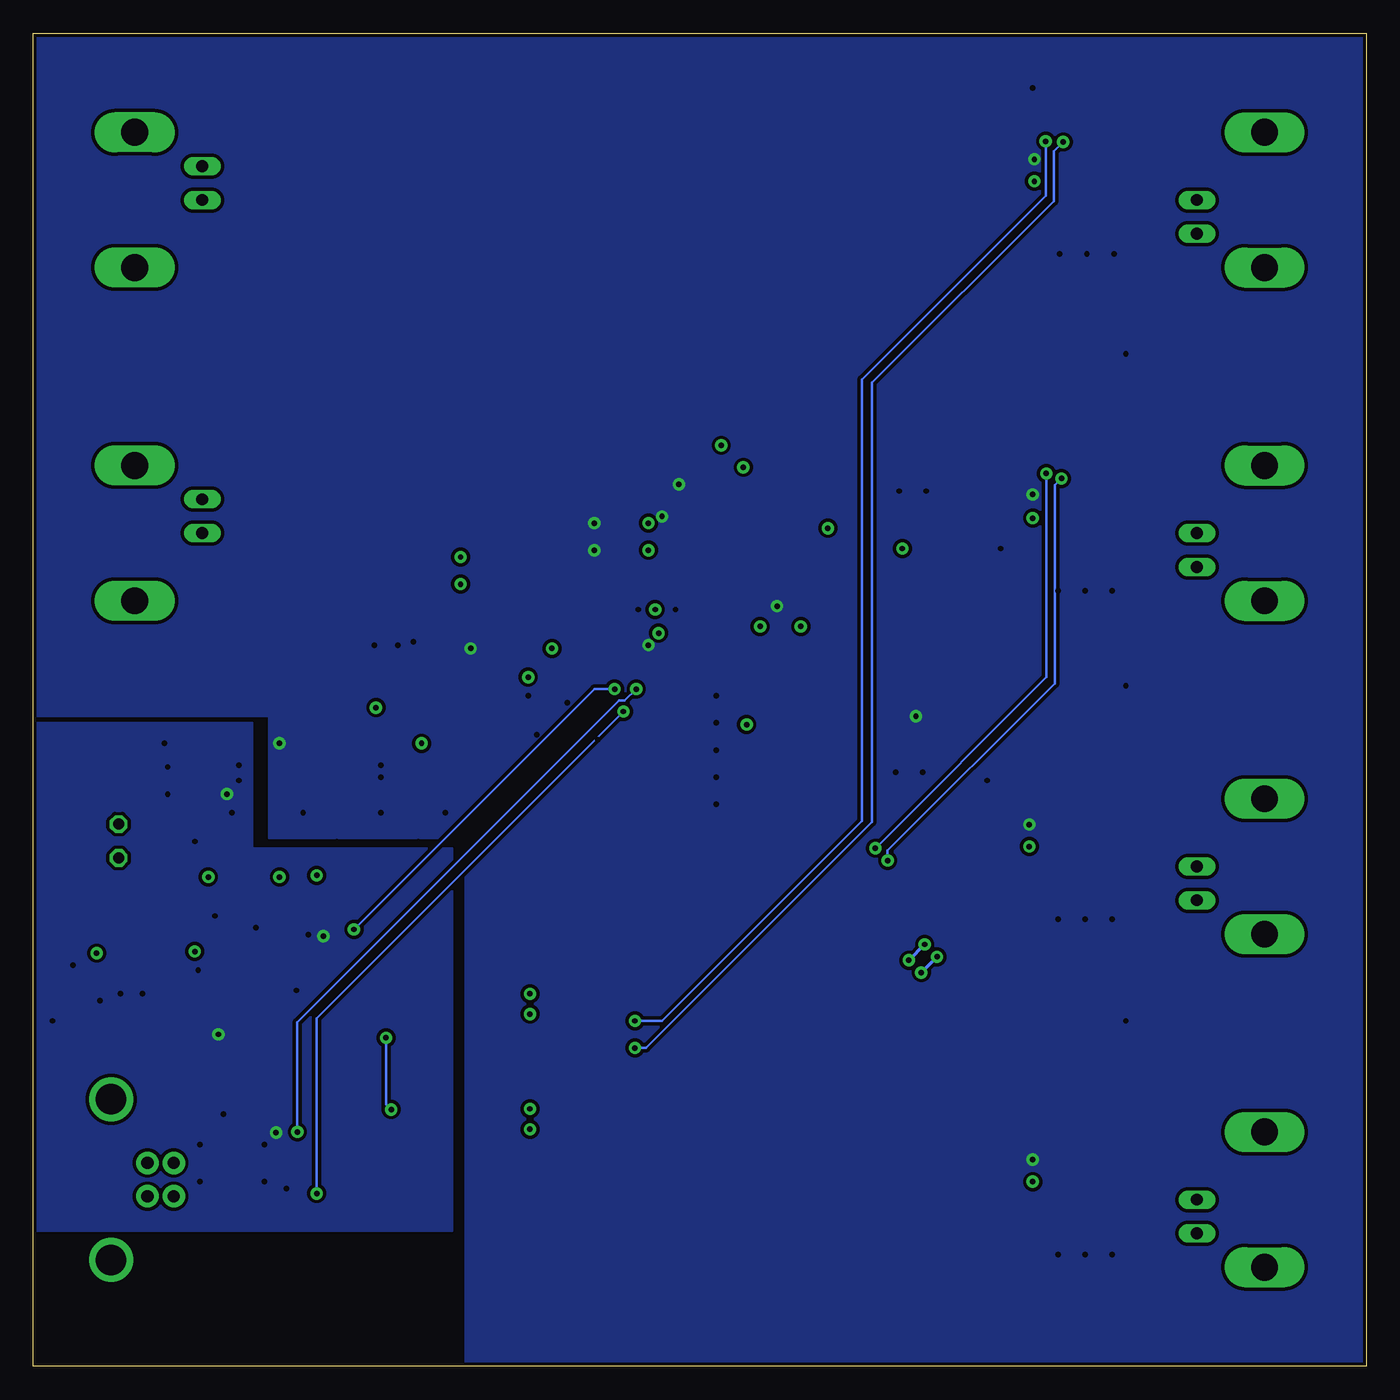
[diagram p5: board, bottom side, seen from below]

Size 100 x 100 mm. Coordinates in mm from the lower left corner, seen from the top.
Outline: 0,0 100,0 100,100 0,100 0,0
Copper layers ([2:[15:1+2*15+16]]): Top 0.035mm / dielectric 0.2mm / Route2 0.035mm / dielectric 1.2mm / Route15 0.035mm / dielectric 0.2mm / Bottom 0.035mm
Design rules "JLC4": minimum track width 4mil, minimum drill 0.2mm, track to track 4mil, track to pad 0.2mm, pad to pad 5mil, via to via 8mil, smd to smd 0mil, copper to edge 0.2mm, drill to drill 8mil, minimum pad ring 10mil, minimum via ring 10mil, stop-mask expansion 4mil, vias tented up to drill 20mil, thermal gap 10mil

### Footprints (pad centres in the part's own frame; a part is rotated, then mirrored left to right if it is on the bottom)
C0603 = smd 1.1 x 1: 1 -0.85,0; 2 0.85,0
SMA(UNI) = smd 2 x 2: 1 -2,0; 2 2,0
SOD323 = smd 0.8 x 0.6: A 1.25,0; C -1.25,0
1812L = smd 2.03 x 3.3: 1 -2.16,0; 2 2.16,0
DLP11SN331HL2L = smd 0.5 x 0.3: 1 -0.6,0.275; 2 0.6,0.275; 3 -0.6,-0.275; 4 0.6,-0.275
B6252HB-NPP3G-50 = drill 0.89 long: 2 -2.54,0; POS 0,0 | drill 2.01 long: 3 -5.08,5.08; 4 5.08,5.08
USB_B_THT = drill 0.914 pad 1.676: 1 4.521,-1.25; 2 4.521,1.25; 3 2.54,1.25; 4 2.54,-1.25 | drill 2.286: S1 -0.178,-6.02; S2 -0.178,6.02
SJ = smd 1.168 x 1.6: 1 -0.762,0; 2 0.762,0
L0805 = smd 1.3 x 1.5: 1 -0.95,0; 2 0.95,0
LED5MM = drill 0.813 octagon: A -1.27,0; K 1.27,0
R0603 = smd 1 x 1.1: 1 -0.85,0; 2 0.85,0
0603-ARV = smd 0.5 x 0.65: 1 -1.2,-0.625; 2 -0.4,-0.625; 3 0.4,-0.625; 4 1.2,-0.625; 5 1.2,0.625; 6 0.4,0.625; 7 -0.4,0.625; 8 -1.2,0.625
B1,27 = smd 1.27 x 1.27: TP 0,0
DCU = smd 0.3 x 0.8: 1 -0.75,-1.55; 2 -0.25,-1.55; 3 0.25,-1.55; 4 0.75,-1.55; 5 0.75,1.55; 6 0.25,1.55; 7 -0.25,1.55; 8 -0.75,1.55
SOT323 = smd 0.4 x 0.95: 1 -0.65,-1.1; 2 0.65,-1.1; 3 0,1.1
SOIC14 = smd 0.559 x 1.981: 1 -4.445,-4.674; 2 -3.175,-4.674; 3 -1.905,-4.674; 4 -0.635,-4.674; 5 0.635,-4.674; 6 1.905,-4.674; 7 3.175,-4.674; 8 3.175,4.674; 9 1.905,4.674; 10 0.635,4.674; 11 -0.635,4.674; 12 -1.905,4.674; 13 -3.175,4.674; 14 -4.445,4.674
SOIC8 = smd 0.6 x 2.2: 1 -1.905,-2.6; 2 -0.635,-2.6; 3 0.635,-2.6; 4 1.905,-2.6; 5 1.905,2.6; 6 0.635,2.6; 7 -0.635,2.6; 8 -1.905,2.6
SOT23-5 = smd 0.55 x 1.2: 1 -0.95,-1.3; 2 0,-1.3; 3 0.95,-1.3; 4 0.95,1.3; 5 -0.95,1.3
SOT23-6 = smd 0.55 x 1.2: 1 -0.95,-1.3; 2 0,-1.3; 3 0.95,-1.3; 4 0.95,1.3; 5 0,1.3; 6 -0.95,1.3
SSOP16 = smd 0.45 x 1.5: 1 -2.264,-2.99; 2 -1.614,-2.99; 3 -0.964,-2.99; 4 -0.314,-2.99; 5 0.336,-2.99; 6 0.986,-2.99; 7 1.636,-2.99; 8 2.286,-2.99; 9 2.286,2.86; 10 1.636,2.86; 11 0.986,2.86; 12 0.336,2.86; 13 -0.314,2.86; 14 -0.964,2.86; 15 -1.614,2.86; 16 -2.264,2.86
SSOP20 = smd 0.4 x 1.5: 1 -2.955,-3.625; 2 -2.305,-3.625; 3 -1.655,-3.625; 4 -1.005,-3.625; 5 -0.355,-3.625; 6 0.295,-3.625; 7 0.945,-3.625; 8 1.595,-3.625; 9 2.245,-3.625; 10 2.895,-3.625; 11 2.895,3.625; 12 2.245,3.625; 13 1.595,3.625; 14 0.945,3.625; 15 0.295,3.625; 16 -0.355,3.625; 17 -1.005,3.625; 18 -1.655,3.625; 19 -2.305,3.625; 20 -2.955,3.625
ILCX13 = smd 1.4 x 1.15: 1 -1.092,-0.787; 2 1.092,-0.787; 3 1.092,0.787; 4 -1.092,0.787

### Placement (x,y rotation side)
C1  23.62,39.88 270 top
C2  23.62,14.73 270 top
C3  92.96,24.89 270 top
C4  33.27,46.74 270 top
C5  30.48,43.94 180 top
C6  35.31,46.74 270 top
C7  91.44,30.23 270 top
C8  35.05,63.5 90 top
C9  93.47,30.23 270 top
C10  83.57,15.24 180 top
C11  30.48,45.97 180 top
C12  37.85,45.97 0 top
C13  86.61,15.24 0 top
C14  46.48,53.34 90 top
C15  46.48,50.29 270 top
C16  62.23,45.34 90 top
C17  50.93,42.16 180 top
C18  23.62,64.52 270 top
C19  23.5,89.79 270 top
C20  50.93,44.2 180 top
C21  69.34,54.36 0 top
C22  59.94,51.82 270 top
C23  72.64,51.82 90 top
C24  27.43,59.18 90 top
C25  33.02,63.5 90 top
C26  37.85,64.26 0 top
C27  30.48,64.26 180 top
C28  41.66,57.66 270 top
C29  46.74,65.28 90 top
C30  47.75,56.39 0 top
C31  49.28,65.28 180 top
C32  50.93,46.23 180 top
C33  50.93,48.26 180 top
C34  50.93,50.29 180 top
C35  79.38,34.67 270 top
C36  55.88,63.25 180 top
C37  85.09,39.37 90 top
C38  79.76,39.37 90 top
C39  69.09,39.37 270 top
C40  76.71,42.93 180 top
C41  55.88,61.21 180 top
C42  57.91,51.82 270 top
C43  87.76,42.93 0 top
C44  82.42,42.93 0 top
C45  71.75,43.05 180 top
C46  74.42,39.37 90 top
C47  87.76,44.96 0 top
C48  82.42,44.96 0 top
C49  71.75,45.09 180 top
C50  81.03,15.49 270 top
C51  86.36,27.94 90 top
C52  86.36,31.5 90 top
C53  80.26,30.23 270 top
C54  68.58,51.82 270 top
D1  18.03,47.24 90 top
D2  18.03,22.1 90 top
D3  97.03,30.48 270 top
D6  18.03,72.14 90 top
D7  21.21,96.14 0 top
D10  74.42,51.82 270 top
D11  61.72,60.33 0 top
D12  61.72,58.93 0 top
D13  68.07,20.83 180 top
D14  87.76,46.74 180 top
D15  68.07,19.3 180 top
D16  68.07,17.78 180 top
D17  68.07,16.26 180 top
D18  68.07,29.46 180 top
D19  68.07,27.94 180 top
D20  68.07,26.42 180 top
D21  68.07,24.89 180 top
F1  89.41,24.89 90 top
FL1  85.09,9.14 90 top
J1  12.7,37.5 90 top
J2  12.7,12.5 90 top
J3  93.98,14 180 top
J4  12.7,62.5 90 top
J5  12.7,87.5 90 top
J6  87.32,87.5 270 top
J7  87.32,62.5 270 top
JP1  78.74,15.49 90 top
JP2  75.95,30.23 270 top
L1  18.03,39.88 90 top
L2  18.03,14.73 90 top
L3  97.03,24.89 270 top
L4  95,24.89 270 top
L5  89.41,30.23 270 top
L6  17.91,64.77 90 top
L7  17.91,89.79 90 top
L8  81.79,87.5 180 top
L9  81.79,62.48 180 top
L10  73.91,35.81 180 top
L11  66.17,47.75 0 top
L12  59.94,21.84 180 top
L13  59.94,19.81 180 top
L14  59.94,16.76 180 top
L15  59.94,14.73 180 top
L16  59.94,30.99 180 top
L17  59.94,28.96 180 top
L18  59.94,25.91 180 top
L19  59.94,23.88 180 top
L20  61.72,57.15 180 top
L21  61.72,63.25 90 top
LED1  93.6,39.4 270 top
R1  18.92,42.93 0 top
R2  18.92,17.78 0 top
R3  23.11,35.81 90 top
R4  23.11,10.67 90 top
R5  21.08,35.81 90 top
R6  21.08,10.67 90 top
R7  19.05,35.81 90 top
R8  19.05,10.67 90 top
R9  86.23,11.94 90 top
R10  83.95,11.94 90 top
R11  30.48,48.01 180 top
R12  37.85,48.01 0 top
R13  42.16,53.21 0 top
R14  42.16,51.18 0 top
R15  18.8,67.82 0 top
R16  18.8,93.09 0 top
R17  64.26,54.1 0 top
R18  23.11,60.45 90 top
R19  22.99,85.72 90 top
R20  70.61,51.82 270 top
R21  21.08,60.45 90 top
R22  20.95,85.72 90 top
R23  19.05,60.45 90 top
R24  18.92,85.72 90 top
R25  37.85,62.23 0 top
R26  30.48,62.23 180 top
R27  40.77,60.2 0 top
R28  42.55,64.39 0 top
R29  57.91,55.37 270 top
R30  65.79,60.71 180 top
R31  65.79,58.67 180 top
R32  78.23,30.23 90 top
R33  93.6,44.45 90 top
R34  69.72,49.28 0 top
RN1  64.52,18.54 270 top
RN2  64.52,27.18 270 top
TP1  21.34,43.18 0 top
TP2  21.46,18.8 0 top
TP3  87.88,32.51 90 top
TP4  91.31,42.93 0 top
TP5  44.7,53.21 0 top
TP6  44.7,51.18 0 top
TP7  60.45,48.26 0 top
TP8  21.08,67.82 0 top
TP9  20.95,93.09 0 top
TP10  72.64,49.28 0 top
TP11  43.05,60.2 180 top
TP12  44.96,64.39 0 top
TP13  74.42,42.93 0 top
TP14  85.47,42.93 0 top
TP15  80.14,42.93 0 top
TP16  69.47,43.05 0 top
TP17  78.74,12.95 90 top
TP18  75.95,32.77 0 top
U1  21.34,39.88 0 top
U2  21.34,14.73 0 top
U3  85.09,6.1 180 top
U4  34.8,55.12 0 top
U5  56.9,45.09 90 top
U6  21.34,64.52 0 top
U7  65.53,51.31 270 top
U8  21.21,89.79 0 top
U9  45.97,59.69 180 top
U10  50.55,61.72 270 top
U11  54.1,55.37 180 top
U12  87.88,39.37 0 top
U13  82.55,39.37 0 top
U14  71.88,39.37 0 top
U15  77.22,39.37 0 top
U16  81.79,22.61 180 top
Y1  83.31,30.23 90 top

### Tracks (layer width: path | path; a pad name or v marks a point on that pad's centre or on a via)
-5V
  Top 0.203: TP13.TP 74.42,42.35 75.48,41.29 75.48,39.62 76.27,38.83 U15.1
  Top 0.254: U15.1 76.27,37.59 | 76.27,37.59 76.27,36.13 75.95,35.81 L10.1 | C46.1 75.35,37.59 76.27,37.59
ADC_CH0
  Top 0.254: R13.2 TP5.TP 44.74,53.21 45.47,52.49 C14.1 48.01,52.49 49.91,54.4 52.28,54.4 53.12,53.56 U11.11
ADC_CH1
  Top 0.254: U11.10 52.47,53.45 52.07,53.85 50.29,53.85 47.59,51.14 C15.1 46.44,51.18 TP6.TP R14.2
ADC_CH2
  Top 0.254: U9.4 45.02,59.25 45.22,59.44 52.19,59.44 52.47,59.17 U11.7
ADC_CH3
  Top 0.254: U10.4 52.77,60.77 53.12,60.42 U11.6
CH0_SW1
  Top 0.152: RN1.8 65.14,20.08 63.37,21.84 L12.1
  Top 0.203: D13.A 66.29,20.83 66.04,20.57 66.04,20.07 65.72,19.74 RN1.8
CH0_SW2
  Top 0.152: RN1.7 64.75,18.94 64.52,19.18 64.52,20.08 64.33,20.27 62.59,20.27 62.13,19.81 L13.1
  Top 0.203: D15.A 66.29,19.3 65.93,18.94 RN1.7
CH1_SW1
  Top 0.152: RN1.6 64.76,18.14 64.52,17.9 64.52,16.89 64.39,16.76 L14.1
  Top 0.203: D16.A 66.29,17.78 65.93,18.14 RN1.6
CH1_SW2
  Top 0.152: RN1.5 65.14,16.96 62.91,14.73 L15.1
  Top 0.203: D17.A 66.29,16.26 66.04,16.51 66.04,17.02 65.72,17.34 RN1.5
CH2_SW1
  Top 0.152: RN2.8 65.14,28.71 62.86,30.99 L16.1
  Top 0.203: D18.A 66.29,29.46 66.04,29.21 66.04,28.7 65.72,28.38 RN2.8
CH2_SW2
  Top 0.152: RN2.7 64.73,27.58 64.49,27.82 64.49,28.74 64.33,28.9 60.95,28.9 L17.1
  Top 0.203: D19.A 66.29,27.94 65.93,27.58 RN2.7
CH2_SW3
  Top 0.203: L20.1 65.28,57.15 65.79,57.66 65.79,59.86 R30.2
  Top 0.254: R30.2 64.14,60.71 63.75,60.33 D11.A
CH3_SW1
  Top 0.152: RN2.6 64.72,26.78 64.49,26.55 64.49,25.61 64.33,25.45 62.59,25.45 62.13,25.91 L18.1
  Top 0.203: D20.A 66.29,26.42 65.93,26.78 RN2.6
CH3_SW2
  Top 0.152: RN2.5 65.13,25.96 65.13,25.64 63.37,23.88 L19.1
  Top 0.203: D21.A 66.29,24.89 66.04,25.15 66.04,25.65 65.72,25.98 RN2.5
CH3_SW3
  Top 0.203: D12.A 62.23,58.93 61.72,59.44 L21.1
  Top 0.254: R31.2 64.01,58.67 63.75,58.93 D12.A
GND  (via drill 0.41 layers 1-2)
  Top 0.203: C53.2 v80.26,28.19 | Y1.2 84.1,32.08 83.31,32.87 v83.31,32.89 | C51.2 86.36,29.4 86.68,29.72 v87.63,29.72 | C52.2 v86.36,33.78 | v87.5,16.64 87.46,16.6 C13.2 87.46,13.88 v87.5,13.84 | v82.68,13.84 82.72,13.88 C10.2 82.72,16.6 v82.68,16.64 | C50.2 v81.03,13.34 | U16.20 85.67,18.98 v85.72,18.92 | R8.1 v19.05,8.38 | R6.1 v21.08,8.38 | R4.1 v23.11,8.38 | R7.1 v19.05,33.53 | R5.1 v21.08,33.53 | R3.1 v23.11,33.53 | R18.1 v23.11,58.17 | R21.1 v21.08,58.17 | R23.1 v19.05,58.17 | R24.1 v18.92,83.44 | R22.1 v20.95,83.44 | R19.1 v22.99,83.44
  Top 0.254: v98.55,25.91 98.49,25.84 L3.1 L4.1 v95,27.43 | C9.2 v93.47,27.94 | v91.82,27.94 91.44,28.32 C7.2 | D1.2 v18.03,51.05 | v18.03,25.91 D2.2 | v18.03,75.95 D6.2 | D7.2 24.77,96.14 v25.02,95.89 | C4.2 v33.27,44.58 | C6.2 v35.31,44.58 | v35.05,65.66 C8.2 | v33.02,65.66 C25.2 | C39.1 v69.09,41.53 | C46.2 74.42,41.02 v73.91,41.53 73.91,41.74 C45.1 72.64,43.05 73.79,44.2 v73.91,44.2 | C38.2 v79.76,41.53 | C37.2 v85.09,41.53 | v87.88,39.37 U12.2 | v82.55,39.37 U13.2 | v77.22,39.37 U15.2 | v71.12,39.37 70.93,39.18 U14.1 | C49.1 v73.91,45.09 | D14.C v90.17,46.74 | C47.2 v89.92,44.96 | C43.2 v89.92,42.93 TP4.TP | v84.58,45.09 83.4,45.09 C48.2 | v84.58,43.94 84.58,43.56 83.95,42.93 C44.2 | C35.2 v79.38,32.38 | v27.43,61.34 C24.2 | C5.2 v28.45,43.94 | U11.4 54.42,56.96 v54.61,56.77 | U11.8 v51.82,56.77 | C23.2 v72.64,54.1 | D10.C v74.42,54.1 | U7.3 64.17,50.29 v62.87,50.29 | C33.2 v48.77,48.26 | C34.2 v48.77,50.29 | C32.2 v48.77,46.23 | U5.4 v57.66,46.99 | C20.2 v48.77,44.2 | C17.2 v48.77,42.16 | C16.2 v62.23,47.37 | C42.2 v57.91,49.78 | C21.2 v71.5,54.36 | C22.2 v59.94,49.78
  Top 0.305: v97.03,30.1 D3.2
  other vias: 86.11,4.95 84.07,4.95
  pour Route2 (isolate 0.254): -0.51,100.58 100.58,100.58 100.58,-0.51 -0.51,-0.51
  pour Top: 83.82,5.84 86.36,5.84 86.61,5.59 86.61,4.32 86.36,4.06 83.82,4.06 83.57,4.32 83.57,5.59
  pour Top: 82.3,33.02 84.58,33.02 84.84,32.77 84.84,28.7 82.04,28.7 82.04,32.77
N$1
  Top 0.254: C40.1 77.56,42 77.22,41.66 U15.5
N$2
  Top 0.254: C40.2 75.86,42 76.27,41.59 U15.6
N$3
  Top 0.254: C39.2 69.09,37.08 70.36,35.81 L10.2 72.96,36.76 72.83,36.9 U14.3 U14.2
N$4
  Top 0.203: D21.C 69.88,24.89 72.26,22.5 80.21,22.5 82.14,24.43 U16.5
N$5
  Top 0.203: D20.C 70.1,26.42 70.26,26.26 70.26,25.2 72.52,22.94 79.96,22.94 81.49,24.47 U16.6
N$6
  Top 0.203: D19.C 70.1,27.94 70.69,27.36 70.69,25.45 72.77,23.37 79.76,23.37 80.84,24.45 U16.7
N$7
  Top 0.203: D18.C 70.23,29.46 71.12,28.57 71.12,25.65 73.03,23.75 79.5,23.75 80.19,24.44 U16.8
N$8  (via drill 0.41)
  Top 0.203: D17.C 70.16,16.26 v73.15,19.25 | v73.54,24.64 74.05,24.13 79.25,24.13 79.54,24.43 U16.9
  Bottom 0.203: v73.15,19.25 73.53,19.63 v73.53,24.64 v73.54,24.64
N$9
  Top 0.203: D16.C 70.1,17.78 72.39,20.07 80.64,20.07 80.84,19.87 U16.14
N$10
  Top 0.203: D15.C 70.87,19.3 72.01,20.45 80.9,20.45 81.49,19.85 U16.15
N$11
  Top 0.203: D13.C 81.28,20.83 82.14,19.96 U16.16
N$12
  Top 0.254: D11.C 59.71,60.33 59.08,59.69 56.13,59.69 55.72,59.27 U11.2
N$13
  Top 0.254: D12.C 59.71,58.93 59.14,58.36 U11.1
N$14  (via drill 0.41)
  Top 0.203: JP2.1 TP18.TP | v56.39,50.8 56.37,50.82 U11.16
  Bottom 0.203: TP18.TP 57.91,50.8 v56.39,50.8
  other vias: 75.95,32.77
N$15  (via drill 0.41)
  Top 0.203: JP1.1 TP17.TP | U11.15 55.73,51.29 55.58,51.14 55.58,50.46 55.73,50.31 v55.73,49.12
  Bottom 0.203: TP17.TP 78.74,26.11 v55.73,49.12
  other vias: 78.74,12.95
N$20
  Top 0.203: U16.4 82.79,27.04 82.54,27.29 79.39,27.29 78.23,28.45 R32.1
N$21
  Top 0.203: JP1.2 78.74,17.27 79.54,18.07 U16.12
N$22
  Top 0.203: U16.10 78.89,26.77 77.98,27.69 76.71,27.69 75.95,28.45 JP2.2
N$23  (via drill 0.41)
  Top 0.203: U16.13 v80.19,17.58 v80.19,17.57 | v54.76,50.8 55.07,51.1 U11.14
  Bottom 0.203: v54.76,50.8 55.63,49.93 56.06,49.93 80.19,25.81 v80.19,17.57
N$24
  Top 0.203: U11.3 55.07,57.46 55.38,57.15 57.66,57.15 57.91,56.9 R29.1
N$25
  Top 0.254: R33.1 LED1.A
  Top 0.305: R33.1
N$26
  Top 0.254: F1.2 92.58,27.05 92.96,26.67 C3.1
  Top 0.406: F1.2 L5.2
N$29
  Top 0.508: L3.2 97.03,22.89 J3.S1 J3.S2
N$30
  Top 0.203: R10.1 83.95,10.29 84.49,9.74 FL1.2
N$31
  Top 0.203: R9.1 86.23,10.36 85.62,9.74 FL1.4
N$34
  Top 0.305: L11.1 64.26,47.75 63.75,47.24 63.75,44.96 63.28,44.49 C16.1 62.23,44.45 U5.2
N$35
  Top 0.254: U5.5 55.63,46.99 55.88,46.74 55.88,42.67 55.37,42.16 C17.1
N$36
  Top 0.254: C54.2 68.58,50.2 68.87,49.91 R34.1 62.44,49.28 62.03,49.69 62.03,52.29 62.26,52.53 63.45,52.53 63.72,52.26 U7.1
N$37
  Top 0.254: R20.1 C54.1 67.06,51.14 | 67.06,51.14 67.06,50.55 66.87,50.36 U7.4 | 67.06,51.14 66.21,51.14 65.79,51.55 65.79,53.42 R17.2
N$40
  Top 0.203: U16.2 Y1.1 84.68,29.72 86.11,29.72 86.36,29.97 C52.1
N$41
  Top 0.203: U16.3 83.44,27.05 82.55,27.94 81.79,27.94 81.53,28.19 81.53,30.33 82.5,31.29 | 82.5,31.29 Y1.3 | C53.1 80.26,31.75 80.52,32 81.79,32 82.5,31.29
N$42
  Top 0.254: J1.POS 17.69,37.5 18.03,37.85 L1.1
N$43
  Top 0.254: L1.2 18.03,42.89 R1.1 18.03,42.97 D1.1
N$44
  Top 0.254: C11.2 R11.2 29.63,48.81 29.84,49.02 30.23,49.02 30.35,49.15 U4.1 30.35,51.94 30.61,52.2 39.03,52.2 40.04,53.21 R13.1
N$45
  Top 0.203: U1.2 R5.2
N$46  (via drill 0.41)
  Top 0.254: L13.2 57.98,19.81 56.71,21.08 42.59,21.08 34.14,29.53 v33.38,29.53 | v32.2,30.71 32.2,35.11 25.27,42.04 22.44,42.04 22.09,41.68 U1.5
  Bottom 0.254: v33.38,29.53 v32.2,30.71
N$47  (via drill 0.41)
  Top 0.254: L12.2 42.93,21.84 v34.31,30.46 | v33.13,31.64 33.13,35.2 25.83,42.5 22.14,42.5 21.59,41.94 U1.6
  Bottom 0.254: v34.31,30.46 v33.13,31.64
N$48
  Top 0.254: U1.7 21.08,42.93 TP1.TP | TP1.TP 21.04,43.18 20.79,42.93 R1.2 | U4.3 32.89,49.1 32.32,48.52 32.32,44.26 32,43.94 C5.1 31.33,43.27 30.99,42.93 26.16,42.93 25.91,43.18 TP1.TP
N$49
  Top 0.203: U1.1 20.59,37.86 20.32,37.59 19.3,37.59 19.05,37.34 R7.2
N$50
  Top 0.203: U1.3 21.59,37.84 21.84,37.59 22.86,37.59 23.11,37.34 R3.2
N$51
  Top 0.254: U4.2 31.62,49.15 31.33,48.86 R11.1 C11.1
N$52
  Top 0.254: J4.POS 17.54,62.5 17.91,62.87 L6.1
N$53
  Top 0.254: D6.1 17.95,70.05 R15.1 17.95,65.76 L6.2
N$54  (via drill 0.41)
  Top 0.203: v35.9,37.93 36.66,37.93 44.37,30.23 57.72,30.23 L17.2 | v22.86,66.6 22.48,66.6 22.09,66.21 U6.5
  Bottom 0.203: v35.9,37.93 35.9,38.7 23.37,51.23 23.37,66.09 v22.86,66.6
N$55  (via drill 0.41)
  Top 0.203: v36.83,38.86 44.7,30.99 L16.2 | v24,66.98 v24,66.99 23.58,67.41 22.33,67.41 21.59,66.67 U6.6
  Bottom 0.203: v36.83,38.86 24,51.69 v24,66.98
N$56
  Top 0.254: R15.2 TP8.TP | TP8.TP U6.7 | TP8.TP 25.15,67.82 26.16,66.8 26.16,58.67 26.5,58.33 C24.1 28.28,58.33 29.21,57.4 34.54,57.4 35.43,58.29 U4.10
N$57
  Top 0.203: U6.2 R21.2
N$58
  Top 0.203: U6.1 20.59,62.5 20.32,62.23 19.3,62.23 19.05,61.98 R23.2
N$59
  Top 0.203: U6.3 21.63,62.92 21.63,62.44 21.84,62.23 22.86,62.23 23.11,61.98 R18.2
N$61
  Top 0.254: C26.2 R25.2 38.7,61.3 38.35,60.96 | U4.8 37.97,60.58 38.35,60.96 | R27.1 39.12,60.2 38.35,60.96
N$62
  Top 0.254: U4.9 36.7,61.06 36.96,61.32 36.96,62.19 R25.1 C26.1
N$63
  Top 0.254: C28.1 41.62,58.55 R27.2 TP11.TP 43.84,60.99 U9.3
N$64
  Top 0.254: J6.POS L8.1
N$65
  Top 0.254: U9.1 46.92,62.81 46.31,63.43 42.84,63.43 42.57,63.7 42.57,65.07 65,87.5 L8.2
N$66
  Top 0.203: L20.2 59.94,57.15 59.69,56.9 59.69,55.63 59.48,55.42 56.85,55.42 56.39,55.88 51.31,55.88 48.8,58.39 U9.6
N$67
  Top 0.254: J2.POS 17.77,12.5 18.03,12.77 L2.1
N$68
  Top 0.254: L2.2 18.03,17.74 R2.1 18.07,20.06 D2.1
N$69
  Top 0.203: U2.5 22.09,16.54 22.23,16.69 57.04,16.69 L15.2
N$70
  Top 0.203: L14.2 57.65,16.76 57.17,17.24 22.07,17.24 21.63,16.81 21.63,16.33 U2.6
N$71
  Top 0.254: R2.2 20.57,17.78 | U2.7 21.09,17.27 20.57,17.78 | 20.57,17.78 21.46,18.67 TP2.TP 34.29,31.62 34.29,47.24 34.63,47.59 C6.1 35.31,49.02 35.43,49.15 U4.5
N$72
  Top 0.203: U2.2 R6.2
N$73
  Top 0.203: U2.1 20.59,12.71 20.32,12.45 19.3,12.45 19.05,12.19 R8.2
N$74
  Top 0.203: U2.3 21.59,12.7 21.81,12.48 21.84,12.45 22.86,12.45 23.11,12.19 R4.2
N$75
  Top 0.254: C12.2 R12.2 38.7,48.93 37.97,49.66 U4.7 38.48,50.44 39.22,51.18 R14.1
N$76
  Top 0.254: C12.1 R12.1 37,48.88 36.7,49.17 U4.6
N$77
  Top 0.254: J5.POS 12.83,87.63 17.52,87.63 17.91,88.01 L7.1
N$78
  Top 0.254: L7.2 17.95,90.78 R16.1 17.91,93.13 17.91,96.01 18.03,96.14 D7.1
N$79  (via drill 0.41)
  Top 0.203: L19.2 v54.86,23.88 | v22.73,91.85 22.21,91.85 21.96,91.59 U8.5
  Bottom 0.203: v54.86,23.88 54.02,23.88 37.08,40.81 37.08,73.78 23.44,87.42 23.44,91.14 v22.73,91.85
N$80  (via drill 0.41)
  Top 0.203: L18.2 v54.86,25.91 | U8.6 21.46,91.95 22.18,92.66 23.32,92.66 24.04,91.94 v24.04,91.9
  Bottom 0.203: v54.86,25.91 52.83,25.91 37.85,40.89 37.85,74.03 24.04,87.83 v24.04,91.9
N$81
  Top 0.254: C25.1 33.02,61.21 32.89,61.09 U4.12 32.89,58.55 32.51,58.17 29.97,58.17 28.7,59.44 28.7,90.17 25.78,93.09 TP9.TP | TP9.TP R16.2 | TP9.TP U8.7
N$82
  Top 0.203: U8.2 R22.2
  Top 0.254: R22.2
N$83
  Top 0.203: U8.1 20.46,87.77 20.19,87.5 19.18,87.5 18.92,87.25 R24.2
N$84
  Top 0.203: U8.3 21.46,87.72 21.67,87.51 21.71,87.51 21.72,87.5 22.73,87.5 22.99,87.25 R19.2
N$85
  Top 0.254: U4.14 30.35,61.09 30.23,61.21 29.84,61.21 29.63,61.43 R26.2 C27.2 29.63,66.46 29.97,66.8 39.62,66.8 40.39,66.04 40.39,64.77 40.77,64.39 R28.1
N$86
  Top 0.254: U4.13 31.62,61.09 31.33,61.38 R26.1 C27.1
N$87
  Top 0.254: R28.2 TP12.TP 46.7,64.39 C29.1 47.46,64.43 47.75,64.14 47.75,61.09 48.07,60.77 U10.3
N$88
  Top 0.254: J7.POS 82.75,62.5 L9.1
N$89
  Top 0.254: U10.1 49.46,62.67 53.09,66.29 75.18,66.29 78.99,62.48 L9.2
N$90
  Top 0.203: L21.2 61.72,65.02 61.21,65.53 53.34,65.53 51.85,64.04 U10.6
USB-D_N
  Top 0.203: U16.18 83.44,17.65 84.42,16.68 C10.1 84.42,13.8 83.95,13.34 R10.2
USB-D_P
  Top 0.203: U16.19 84.09,17.76 85.76,16.09 C13.1 85.76,13.8 86.23,13.34 R9.2
USBD_N
  Top 0.203: U3.2 84.44,8.17 FL1.1 84.81,8.82 85.13,9.14 85.85,9.14 arc90 86.11,9.4 arc-90 86.36,9.65 arc-90 86.61,9.4 arc90 86.87,9.14 87.26,9.14 89.46,11.34 J3.2
USBD_P
  Top 0.203: U3.1 85.74,8.17 85.4,8.51 | 85.4,8.51 FL1.3 | 85.4,8.51 85.56,8.67 87.36,8.67 J3.3
USBGND
  Top 0.406: L4.2 95,23.11 94.49,22.61 92.96,22.61 | 92.96,22.61 91.44,21.08 J3.4 | C3.2 92.96,22.61
V_REF
  Top 0.254: C32.1 C33.1 | C33.1 C34.1 51.78,52.47 U11.9 | C20.1 C32.1 | U5.6 53.05,45.72 52.54,46.23 C32.1 | C33.1 TP7.TP 60.49,48.26 61.29,49.06 61.29,52.69 62.7,54.1 R17.1
VAA  (via drill 0.41)
  Top 0.203: U2.8 20.59,15.74 20.83,15.49 23.53,15.49 C2.1 | U1.8 20.59,40.95 20.85,40.68 23.67,40.68 | U6.8 20.63,66.02 20.63,65.54 20.81,65.36 22.36,65.36 22.37,65.37 C18.1 23.66,65.41 v25.02,65.41 | U8.8 20.46,90.86 20.72,90.59 23.54,90.59 | v24.89,90.55 23.58,90.55 23.54,90.59 | 23.54,90.59 C19.1
  Top 0.254: v25.02,15.49 23.71,15.49 C2.1 | v25.27,40.64 23.71,40.64 23.67,40.68 C1.1 | U4.4 34.16,49.15 v33.78,48.77 33.27,48.26 C4.1 | C44.1 81.6,42.9 U13.5 | C44.1 C48.1 81.57,46.7 v81.53,46.74 | TP15.TP C44.1 | v53.85,54.1 53.77,54.02 U11.12 | C41.1 v57.91,61.21 | C36.1 v57.91,63.25 | C21.1 67.69,54.36 v67.18,53.85 66.83,53.5 U7.5 | U9.5 45.97,57.88 45.12,57.02 | v44.2,57.02 45.12,57.02 | 45.12,57.02 45.75,56.39 C30.1 | v52.83,63.75 52.83,62.23 52.32,61.72 U10.5 | C31.1 51.05,65.28 51.56,65.79 v51.56,66.17
  pour Bottom (isolate 0.254): -1.52,101.6 101.6,101.6 101.6,48.77 82.3,48.77 82.3,39.62 67.56,39.62 67.56,-1.52 -1.52,-1.52
VBUS  (via drill 0.41)
  Top 0.254: U15.4 U15.3 78.17,37.28 78.61,36.83 v78.74,36.83 79.38,36.2 C35.1 | U12.3 88.83,37.02 88.52,36.7 v86.87,36.7 | C37.1 85.09,37.59 85.98,36.7 v86.87,36.7 | U13.3 83.5,37.02 83.19,36.7 v81.53,36.7 | C38.1 79.76,37.59 80.64,36.7 v81.53,36.7 | U13.1 81.6,36.77 v81.53,36.7 | U12.1 86.93,36.77 v86.87,36.7
  Top 0.305: D3.1 97.03,31.25 96.77,30.99 v95.25,30.99 93.56,30.99 | C9.1 C7.1 89.51,31.08 | 89.51,31.08 L5.1 | 89.51,31.08 87.92,31.08 v87.88,31.11 TP3.TP
  pour Route15 (isolate 0.254): 68.33,25.91 99.06,25.91 arc1 99.06,39.88 68.33,39.88
VDD  (via drill 0.41)
  Top 0.254: R33.2 93.6,46.48 92.51,47.57 86.69,47.57 86.51,47.39 | v86.11,24.89 86.11,26.16 | 86.11,26.16 84.81,26.16 U16.1 | 86.11,26.16 86.36,26.42 C51.1 | v78.23,32.26 R32.2 | C50.1 81.03,17.27 81.28,17.53 v81.79,17.53 82.55,17.53 82.8,17.78 82.8,18.97 U16.17 | U12.5 86.93,44.13 86.91,44.16 C43.1 | C43.1 C47.1 86.91,45.81 86.49,46.23 86.49,46.72 D14.A | TP14.TP C43.1 | U11.13 54.42,53.4 54.61,53.59 57.91,53.59 | R29.2 57.91,53.59 | C42.1 57.91,53.59
  Top 0.305: D14.A 86.51,47.39 | 86.51,47.39 78.17,55.73 61.57,55.73 59.44,53.59 57.91,53.59 | 86.51,47.39 86.36,47.24 82.25,47.24 81.89,47.6 67.27,47.6 L11.2
  other vias: 85.47,42.93
  pour Bottom (isolate 0.254): 83.57,48.26 101.6,48.26 101.6,10.16 68.58,10.16 68.58,38.86 83.57,38.86
VSS  (via drill 0.41)
  Top 0.203: U2.4 22.09,13.7 22.26,13.88 C2.2 | C1.2 22.26,39.03 22.09,38.85 U1.4 | U6.4 22.09,63.49 22.26,63.67 C18.2 23.66,63.63 v25.02,63.63 | v24.89,88.9 23.53,88.9 C19.2 22.14,88.94 21.96,88.76 U8.4 | RN1.1 63.18,19.74 v62.74,19.3 63.1,18.94 RN1.2 | RN1.3 63.1,18.14 v62.74,17.78 63.18,17.34 RN1.4 | RN2.4 63.18,25.98 v62.74,26.42 63.1,26.78 RN2.3 | RN2.2 63.1,27.58 v62.74,27.94 63.18,28.38 RN2.1
  Top 0.254: v25.02,13.84 23.66,13.84 C2.2 | v25.27,38.99 23.66,38.99 C1.2 | U4.11 34.16,61.09 34.42,61.34 v34.8,61.34 34.8,61.38 35.05,61.63 C8.1 | C45.2 TP16.TP | C45.2 70.93,43.03 U14.5 | C45.2 C49.2 70.91,46.7 v70.87,46.74 | R30.1 v67.94,60.71 | R31.1 v67.94,58.67 | v62.87,51.69 63.25,51.31 U7.2 65.02,51.31 65.28,51.56 65.28,52.83 65.01,53.1 64.6,53.1 64.24,53.46 64.24,54.79 63.92,55.11 62.38,55.11 61.09,53.81 | U9.2 45.97,62.26 45.37,62.87 v40.39,62.87 | C30.2 49.87,56.39 51.27,54.99 v53.09,54.99 | v48.39,69.09 48.43,69.05 C31.2 48.43,63.19 48.32,63.08 48.32,61.92 48.51,61.72 U10.2 | C22.1 61.09,53.81 | 61.09,53.81 v61.09,53.85
  pour Route15 (isolate 0.254, rank 2): -1.02,101.09 101.09,101.09 101.09,45.97 67.56,45.97 67.56,-1.02 -1.02,-1.02
VSSA  (via drill 0.41)
  Top 0.254: v53.34,56.77 53.77,57.2 U11.5 53.77,61.13 v53.85,61.21 | TP10.TP R34.2 70.61,49.31 R20.2 | C23.1 TP10.TP | TP10.TP 74.17,49.28 v74.3,49.4 74.42,49.53 D10.A | C15.2 v46.48,48.13 | v45.47,55.5 45.97,55.5 46.48,54.99 C14.2 | C36.2 v53.85,63.25 v53.85,61.21 | C41.2 v53.85,61.21 | v42.42,55.5 41.66,56.26 C28.2 | C29.2 v46.74,67.44
  pour Route15 (isolate 0.254): 46.74,68.33 59.94,68.33 68.6,56.64 73.91,56.64 75.69,54.86 75.69,49.02 74.68,48.01 70.61,48.01 62.74,55.88 51.56,55.88 47.75,52.07 47.75,47.5 47.24,46.99 44.96,46.99 40.89,51.05 40.89,62.48
VUSB
  Top 0.406: J3.1 89.46,22.68 F1.1

### Text on the board
Document: A little schematic adjustment / to straighten the design here / is needed